# EAGLE schematic oresat-acs-card (EAGLE 9.6.2)

## Sheet 1 of 8: Connectors
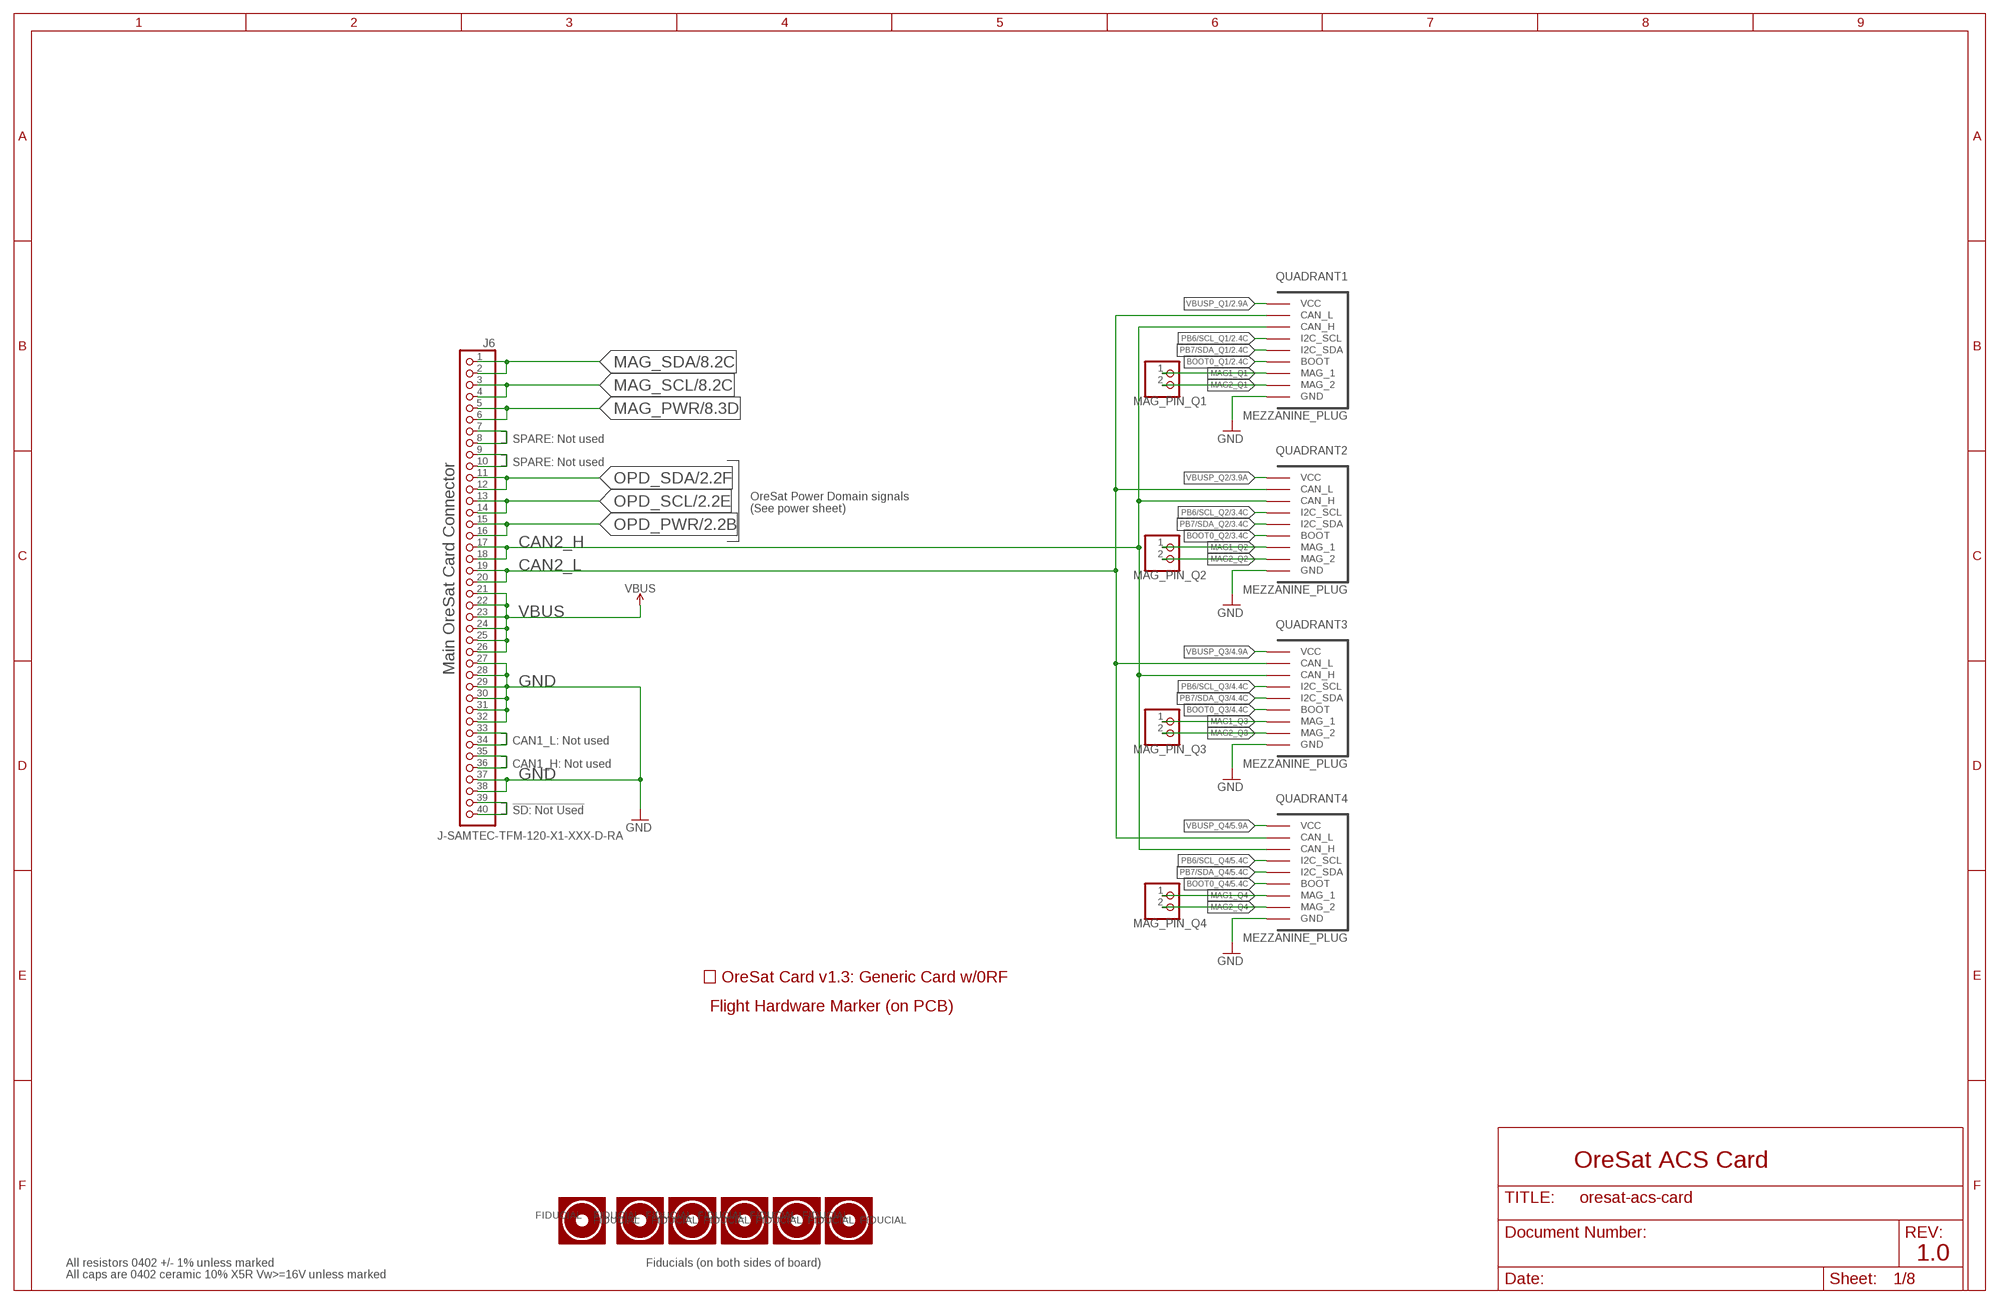
[diagram p0: schematic, sheet 1]

### Parts
FIDUCIAL1  FIDUCIAL-1.0X2.0  [FIDUCIAL-1.0X2.0]
FIDUCIAL2  FIDUCIAL-1.0X2.0  [FIDUCIAL-1.0X2.0]
FIDUCIAL3  FIDUCIAL-1.0X2.0  [FIDUCIAL-1.0X2.0]
FIDUCIAL4  FIDUCIAL-1.0X2.0  [FIDUCIAL-1.0X2.0]
FIDUCIAL5  FIDUCIAL-1.0X2.0  [FIDUCIAL-1.0X2.0]
FIDUCIAL6  FIDUCIAL-1.0X2.0  [FIDUCIAL-1.0X2.0]
J6  J-SAMTEC-TFM-120-X1-XXX-D-RA  [J-SAMTEC-TFM-120-X1-XXX-D-RA]
MAG_PIN_Q1  PINHD-1X2  [1X02]
MAG_PIN_Q2  PINHD-1X2  [1X02]
MAG_PIN_Q3  PINHD-1X2  [1X02]
MAG_PIN_Q4  PINHD-1X2  [1X02]
PCB1  ORESAT-CARD-V1.3-GENERIC-0RF  [ORESAT-CARD-V1.3-GENERIC-0RF]
QUADRANT1  MEZZANINE_PLUG  [MEZZANINE_PLUG]
QUADRANT2  MEZZANINE_PLUG  [MEZZANINE_PLUG]
QUADRANT3  MEZZANINE_PLUG  [MEZZANINE_PLUG]
QUADRANT4  MEZZANINE_PLUG  [MEZZANINE_PLUG]
U$1  FLIGHMARKERNEW  [FLIGHTMARKER_NEW_BOARDS]

### Nets
BOOT0_Q1: QUADRANT1.P$9(BOOT) QUADRANT1.P$22(BOOT) ; also sheet 2
BOOT0_Q2: QUADRANT2.P$9(BOOT) QUADRANT2.P$22(BOOT) ; also sheet 3
BOOT0_Q3: QUADRANT3.P$9(BOOT) QUADRANT3.P$22(BOOT) ; also sheet 4
BOOT0_Q4: QUADRANT4.P$9(BOOT) QUADRANT4.P$22(BOOT) ; also sheet 5
CAN2_H: J6.17 J6.18 QUADRANT1.P$6(CAN_H) QUADRANT1.P$25(CAN_H) QUADRANT2.P$6(CAN_H) QUADRANT2.P$25(CAN_H) QUADRANT3.P$6(CAN_H) QUADRANT3.P$25(CAN_H) QUADRANT4.P$6(CAN_H) QUADRANT4.P$25(CAN_H) ; also sheet 7
CAN2_L: J6.19 J6.20 QUADRANT1.P$5(CAN_L) QUADRANT1.P$26(CAN_L) QUADRANT2.P$5(CAN_L) QUADRANT2.P$26(CAN_L) QUADRANT3.P$5(CAN_L) QUADRANT3.P$26(CAN_L) QUADRANT4.P$5(CAN_L) QUADRANT4.P$26(CAN_L) ; also sheet 7
GND: J6.27 J6.28 J6.29 J6.30 J6.31 J6.32 J6.37 J6.38 QUADRANT1.P$1(GND) QUADRANT1.P$2(GND) QUADRANT1.P$14(GND) QUADRANT1.P$15(GND) QUADRANT1.P$16(GND) QUADRANT1.P$17(GND) QUADRANT1.P$29(GND) QUADRANT1.P$30(GND) QUADRANT2.P$1(GND) QUADRANT2.P$2(GND) QUADRANT2.P$14(GND) QUADRANT2.P$15(GND) QUADRANT2.P$16(GND) QUADRANT2.P$17(GND) QUADRANT2.P$29(GND) QUADRANT2.P$30(GND) QUADRANT3.P$1(GND) QUADRANT3.P$2(GND) QUADRANT3.P$14(GND) QUADRANT3.P$15(GND) QUADRANT3.P$16(GND) QUADRANT3.P$17(GND) QUADRANT3.P$29(GND) QUADRANT3.P$30(GND) QUADRANT4.P$1(GND) QUADRANT4.P$2(GND) QUADRANT4.P$14(GND) QUADRANT4.P$15(GND) QUADRANT4.P$16(GND) QUADRANT4.P$17(GND) QUADRANT4.P$29(GND) QUADRANT4.P$30(GND) ; also sheet 2,3,4,5,6,7,8
MAG1_Q1: MAG_PIN_Q1.1 QUADRANT1.P$10(MAG_1) QUADRANT1.P$21(MAG_1)
MAG1_Q2: MAG_PIN_Q2.1 QUADRANT2.P$10(MAG_1) QUADRANT2.P$21(MAG_1)
MAG1_Q3: MAG_PIN_Q3.1 QUADRANT3.P$10(MAG_1) QUADRANT3.P$21(MAG_1)
MAG1_Q4: MAG_PIN_Q4.1 QUADRANT4.P$10(MAG_1) QUADRANT4.P$21(MAG_1)
MAG2_Q1: MAG_PIN_Q1.2 QUADRANT1.P$11(MAG_2) QUADRANT1.P$20(MAG_2)
MAG2_Q2: MAG_PIN_Q2.2 QUADRANT2.P$11(MAG_2) QUADRANT2.P$20(MAG_2)
MAG2_Q3: MAG_PIN_Q3.2 QUADRANT3.P$11(MAG_2) QUADRANT3.P$20(MAG_2)
MAG2_Q4: MAG_PIN_Q4.2 QUADRANT4.P$11(MAG_2) QUADRANT4.P$20(MAG_2)
MAG_PWR: J6.5 J6.6 ; also sheet 8
MAG_SCL: J6.3 J6.4 ; also sheet 8
MAG_SDA: J6.1 J6.2 ; also sheet 8
N$47: J6.9 J6.10
N$48: J6.7 J6.8
N$49: J6.39 J6.40
N$50: J6.35 J6.36
N$51: J6.33 J6.34
OPD_PWR: J6.15 J6.16 ; also sheet 2,3,4,5,6
OPD_SCL: J6.13 J6.14 ; also sheet 2,3,4,5,6
OPD_SDA: J6.11 J6.12 ; also sheet 2,3,4,5,6
PB6/SCL_Q1: QUADRANT1.P$7(I2C_SCL) QUADRANT1.P$24(I2C_SCL) ; also sheet 2
PB6/SCL_Q2: QUADRANT2.P$7(I2C_SCL) QUADRANT2.P$24(I2C_SCL) ; also sheet 3
PB6/SCL_Q3: QUADRANT3.P$7(I2C_SCL) QUADRANT3.P$24(I2C_SCL) ; also sheet 4
PB6/SCL_Q4: QUADRANT4.P$7(I2C_SCL) QUADRANT4.P$24(I2C_SCL) ; also sheet 5
PB7/SDA_Q1: QUADRANT1.P$8(I2C_SDA) QUADRANT1.P$23(I2C_SDA) ; also sheet 2
PB7/SDA_Q2: QUADRANT2.P$8(I2C_SDA) QUADRANT2.P$23(I2C_SDA) ; also sheet 3
PB7/SDA_Q3: QUADRANT3.P$8(I2C_SDA) QUADRANT3.P$23(I2C_SDA) ; also sheet 4
PB7/SDA_Q4: QUADRANT4.P$8(I2C_SDA) QUADRANT4.P$23(I2C_SDA) ; also sheet 5
VBUS: J6.21 J6.22 J6.23 J6.24 J6.25 J6.26 ; also sheet 2,3,4,5,6
VBUSP_Q1: QUADRANT1.P$3(VCC) QUADRANT1.P$4(VCC) QUADRANT1.P$12(VCC) QUADRANT1.P$13(VCC) QUADRANT1.P$18(VCC) QUADRANT1.P$19(VCC) QUADRANT1.P$27(VCC) QUADRANT1.P$28(VCC) ; also sheet 2
VBUSP_Q2: QUADRANT2.P$3(VCC) QUADRANT2.P$4(VCC) QUADRANT2.P$12(VCC) QUADRANT2.P$13(VCC) QUADRANT2.P$18(VCC) QUADRANT2.P$19(VCC) QUADRANT2.P$27(VCC) QUADRANT2.P$28(VCC) ; also sheet 3
VBUSP_Q3: QUADRANT3.P$3(VCC) QUADRANT3.P$4(VCC) QUADRANT3.P$12(VCC) QUADRANT3.P$13(VCC) QUADRANT3.P$18(VCC) QUADRANT3.P$19(VCC) QUADRANT3.P$27(VCC) QUADRANT3.P$28(VCC) ; also sheet 4
VBUSP_Q4: QUADRANT4.P$3(VCC) QUADRANT4.P$4(VCC) QUADRANT4.P$12(VCC) QUADRANT4.P$13(VCC) QUADRANT4.P$18(VCC) QUADRANT4.P$19(VCC) QUADRANT4.P$27(VCC) QUADRANT4.P$28(VCC) ; also sheet 5
Unconnected: FIDUCIAL1.FIDUCIAL FIDUCIAL2.FIDUCIAL FIDUCIAL3.FIDUCIAL FIDUCIAL4.FIDUCIAL FIDUCIAL5.FIDUCIAL FIDUCIAL6.FIDUCIAL

### Notes on the sheet
- SPARE: Not used
- SPARE: Not used
- OreSat Power Domain signals
  (See power sheet)
- Main OreSat Card Connector
- CAN1_L: Not used
- CAN1_H: Not used
- !SD: Not Used
- OreSat ACS Card
- 1.0
- All resistors 0402 +/- 1% unless marked | Fiducials (on both sides of board)
- All caps are 0402 ceramic 10% X5R Vw>=16V unless marked

## Sheet 2 of 8: Q1 Power Domain
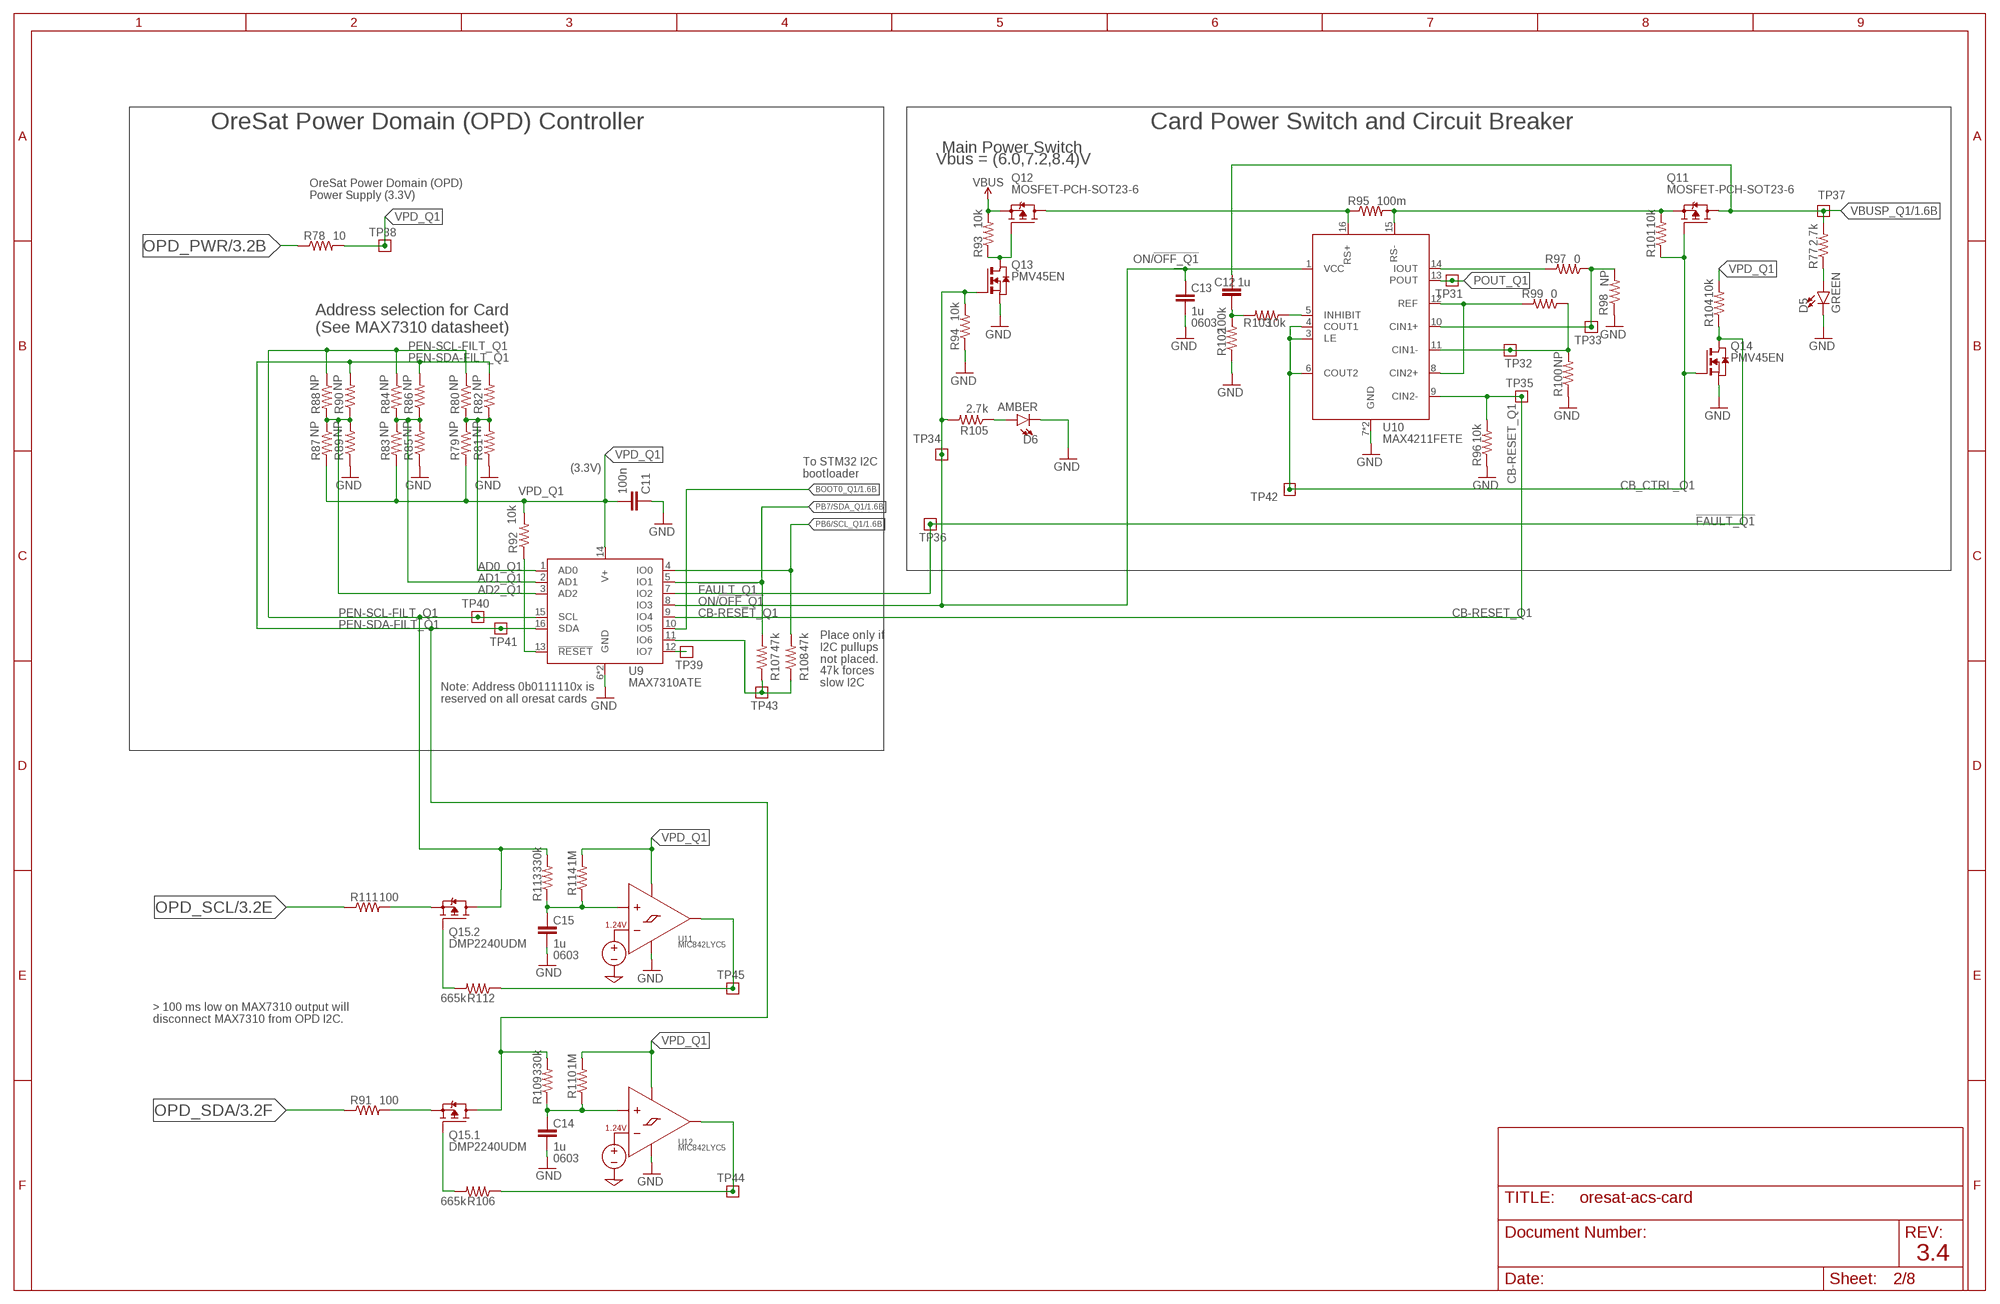
[diagram p1: schematic, sheet 2]

### Parts
C11  100n  C-EU0603-C-NOSILK  [.0603-C-NOSILK]
C12  1u  C-EU0603-C-NOSILK  [.0603-C-NOSILK]
C13  1u  C-EU0603-C-NOSILK  [.0603-C-NOSILK]
C14  1u  C-EU0603-C-NOSILK  [.0603-C-NOSILK]
C15  1u  C-EU0603-C-NOSILK  [.0603-C-NOSILK]
D5  GREEN  LED-GREEN0603  [LED-0603]
D6  AMBER  LED-GREEN0603  [LED-0603]
Q11  MOSFET-PCH-SOT23-6  [SOT23-6]
Q12  MOSFET-PCH-SOT23-6  [SOT23-6]
Q13  PMV45EN  [SOT23]
Q14  PMV45EN  [SOT23]
Q15  DMP2240UDM  MOSFET-PCH-SOT23-6  [SOT23-6]
R77  2.7k  R-US_0603-C-NOSILK  [.0603-C-NOSILK]
R78  10  R-US_0603-C-NOSILK  [.0603-C-NOSILK]
R79  NP  R-US_0603-C-NOSILK  [.0603-C-NOSILK]
R80  NP  R-US_0603-C-NOSILK  [.0603-C-NOSILK]
R81  NP  R-US_0603-C-NOSILK  [.0603-C-NOSILK]
R82  NP  R-US_0603-C-NOSILK  [.0603-C-NOSILK]
R83  NP  R-US_0603-C-NOSILK  [.0603-C-NOSILK]
R84  NP  R-US_0603-C-NOSILK  [.0603-C-NOSILK]
R85  NP  R-US_0603-C-NOSILK  [.0603-C-NOSILK]
R86  NP  R-US_0603-C-NOSILK  [.0603-C-NOSILK]
R87  NP  R-US_0603-C-NOSILK  [.0603-C-NOSILK]
R88  NP  R-US_0603-C-NOSILK  [.0603-C-NOSILK]
R89  NP  R-US_0603-C-NOSILK  [.0603-C-NOSILK]
R90  NP  R-US_0603-C-NOSILK  [.0603-C-NOSILK]
R91  100  R-US_0603-C-NOSILK  [.0603-C-NOSILK]
R92  10k  R-US_0603-C-NOSILK  [.0603-C-NOSILK]
R93  10k  R-US_0603-C-NOSILK  [.0603-C-NOSILK]
R94  10k  R-US_0603-C-NOSILK  [.0603-C-NOSILK]
R95  100m  R-US_R1206  [R1206]
R96  10k  R-US_0603-C-NOSILK  [.0603-C-NOSILK]
R97  0  R-US_0603-C-NOSILK  [.0603-C-NOSILK]
R98  NP  R-US_0603-C-NOSILK  [.0603-C-NOSILK]
R99  0  R-US_0603-C-NOSILK  [.0603-C-NOSILK]
R100  NP  R-US_0603-C-NOSILK  [.0603-C-NOSILK]
R101  10k  R-US_0603-C-NOSILK  [.0603-C-NOSILK]
R102  100k  R-US_0603-C-NOSILK  [.0603-C-NOSILK]
R103  10k  R-US_0603-C-NOSILK  [.0603-C-NOSILK]
R104  10k  R-US_0603-C-NOSILK  [.0603-C-NOSILK]
R105  2.7k  R-US_0603-C-NOSILK  [.0603-C-NOSILK]
R106  665k  R-US_0603-C-NOSILK  [.0603-C-NOSILK]
R107  47k  R-US_0603-C-NOSILK  [.0603-C-NOSILK]
R108  47k  R-US_0603-C-NOSILK  [.0603-C-NOSILK]
R109  330k  R-US_0603-C-NOSILK  [.0603-C-NOSILK]
R110  1M  R-US_0603-C-NOSILK  [.0603-C-NOSILK]
R111  100  R-US_0603-C-NOSILK  [.0603-C-NOSILK]
R112  665k  R-US_0603-C-NOSILK  [.0603-C-NOSILK]
R113  330k  R-US_0603-C-NOSILK  [.0603-C-NOSILK]
R114  1M  R-US_0603-C-NOSILK  [.0603-C-NOSILK]
TP31  TEST-POINT-LARGE-SQUARE  [1X01]
TP32  TEST-POINT-LARGE-SQUARE  [1X01]
TP33  TEST-POINT-LARGE-SQUARE  [1X01]
TP34  TEST-POINT-LARGE-SQUARE  [1X01]
TP35  TEST-POINT-LARGE-SQUARE  [1X01]
TP36  TEST-POINT-LARGE-SQUARE  [1X01]
TP37  TEST-POINT-LARGE-SQUARE  [1X01]
TP38  TEST-POINT-LARGE-SQUARE  [1X01]
TP39  TEST-POINT-LARGE-SQUARE  [1X01]
TP40  TEST-POINT-LARGE-SQUARE  [1X01]
TP41  TEST-POINT-LARGE-SQUARE  [1X01]
TP42  TEST-POINT-LARGE-SQUARE  [1X01]
TP43  TEST-POINT-LARGE-SQUARE  [1X01]
TP44  TEST-POINT-LARGE-SQUARE  [1X01]
TP45  TEST-POINT-LARGE-SQUARE  [1X01]
U9  MAX7310ATE  MAX7310  [QFN65P400X400X80-17T210]
U10  MAX4211FETE  MAX4211  [QFN65P400X400X80-17T210]
U11  MIC842LYC5  [SC70-5]
U12  MIC842LYC5  [SC70-5]

### Nets
!FAULT_Q1: Q14.3(D) R104.1 TP36.1 U9.7(IO2)
AD0_Q1: R79.1 R80.2 R81.2 R82.1 U9.1(AD0)
AD1_Q1: R83.1 R84.2 R85.2 R86.1 U9.2(AD1)
AD2_Q1: R87.1 R88.2 R89.2 R90.1 U9.3(AD2)
BOOT0_Q1: U9.10(IO5) ; also sheet 1
CB-RESET_Q1: R96.2 TP35.1 U9.9(IO4) U10.9(CIN2-)
CB_CTRL_Q1: Q11.3(G) Q14.1(G) R101.1 TP42.1 U10.3(LE) U10.4(COUT1) U10.6(COUT2)
GND: C11.1 C13.2 C14.2 C15.2 D5.C D6.C Q13.2(S) Q14.2(S) R81.1 R85.1 R89.1 R94.1 R96.1 R98.1 R100.1 R102.1 U9.6(GND) U9.EPAD(GND) U10.7(GND) U10.EPAD(GND) U11.2(GND) U12.2(GND) ; also sheet 1,3,4,5,6,7,8
IOUT_Q1: R97.2 U10.14(IOUT)
N$2: TP39.1 U9.12(IO7)
N$28: Q15.3(.2:G) R112.2
N$29: Q15.1(.1:G) R106.2
N$169: D5.A R77.1
N$170: R92.1 U9.13(!RESET)
N$171: Q12.3(G) Q13.3(D) R93.1
N$172: Q12.1(D) Q12.2(D) Q12.5(D) Q12.6(D) R95.1 U10.16(RS+)
N$173: R97.1 R98.2 TP33.1 U10.10(CIN1+)
N$174: R99.1 R100.2 TP32.1 U10.11(CIN1-)
N$175: R99.2 U10.8(CIN2+) U10.12(REF)
N$176: R103.1 U10.5(INHIBIT)
N$177: C12.1 R102.2 R103.2
N$178: Q11.4(S) R95.2 R101.2 U10.15(RS-)
N$179: D6.A R105.1
N$180: Q15.5(.1:S) R91.2
N$181: R106.1 TP44.1 U12.4(OUT)
N$182: R107.1 R108.1 TP43.1 U9.11(IO6)
N$183: Q15.2(.2:S) R111.2
N$184: R112.1 TP45.1 U11.4(OUT)
N$185: C15.1 R113.1 R114.1 U11.1(INP)
N$186: C14.1 R109.1 R110.1 U12.1(INP)
ON/!OFF_Q1: C13.1 Q13.1(G) R94.2 R105.2 TP34.1 U9.8(IO3) U10.1(VCC)
OPD_PWR: R78.1 ; also sheet 1,3,4,5,6
OPD_SCL: R111.1 ; also sheet 1,3,4,5,6
OPD_SDA: R91.1 ; also sheet 1,3,4,5,6
PB6/SCL_Q1: R108.2 U9.4(IO0) ; also sheet 1
PB7/SDA_Q1: R107.2 U9.5(IO1) ; also sheet 1
PEN-SCL-FILT_Q1: Q15.4(.2:D) R80.1 R84.1 R88.1 R113.2 TP40.1 U9.15(SCL)
PEN-SDA-FILT_Q1: Q15.6(.1:D) R82.2 R86.2 R90.2 R109.2 TP41.1 U9.16(SDA)
POUT_Q1: TP31.1 U10.13(POUT)
VBUS: Q12.4(S) R93.2 ; also sheet 1,3,4,5,6
VBUSP_Q1: C12.2 Q11.1(D) Q11.2(D) Q11.5(D) Q11.6(D) R77.2 TP37.1 ; also sheet 1
VPD_Q1: C11.2 R78.2 R79.2 R83.2 R87.2 R92.2 R104.2 R110.2 R114.2 TP38.1 U9.14(V+) U11.5(VDD) U12.5(VDD)

### Notes on the sheet
- OreSat Power Domain (OPD) Controller | Card Power Switch and Circuit Breaker
- Main Power Switch
- Vbus = (6.0,7.2,8.4)V
- OreSat Power Domain (OPD)
  Power Supply (3.3V)
- 0603
- Address selection for Card
  (See MAX7310 datasheet)
- (3.3V)
- To STM32 I2C
  bootloader
- Place only if
  I2C pullups
  not placed.
- 47k forces
  slow I2C
- Note: Address 0b0111110x is 
  reserved on all oresat cards
- 0603
- > 100 ms low on MAX7310 output will
  disconnect MAX7310 from OPD I2C.
- 0603
- 3.4

## Sheet 3 of 8: Q2 Power Domain
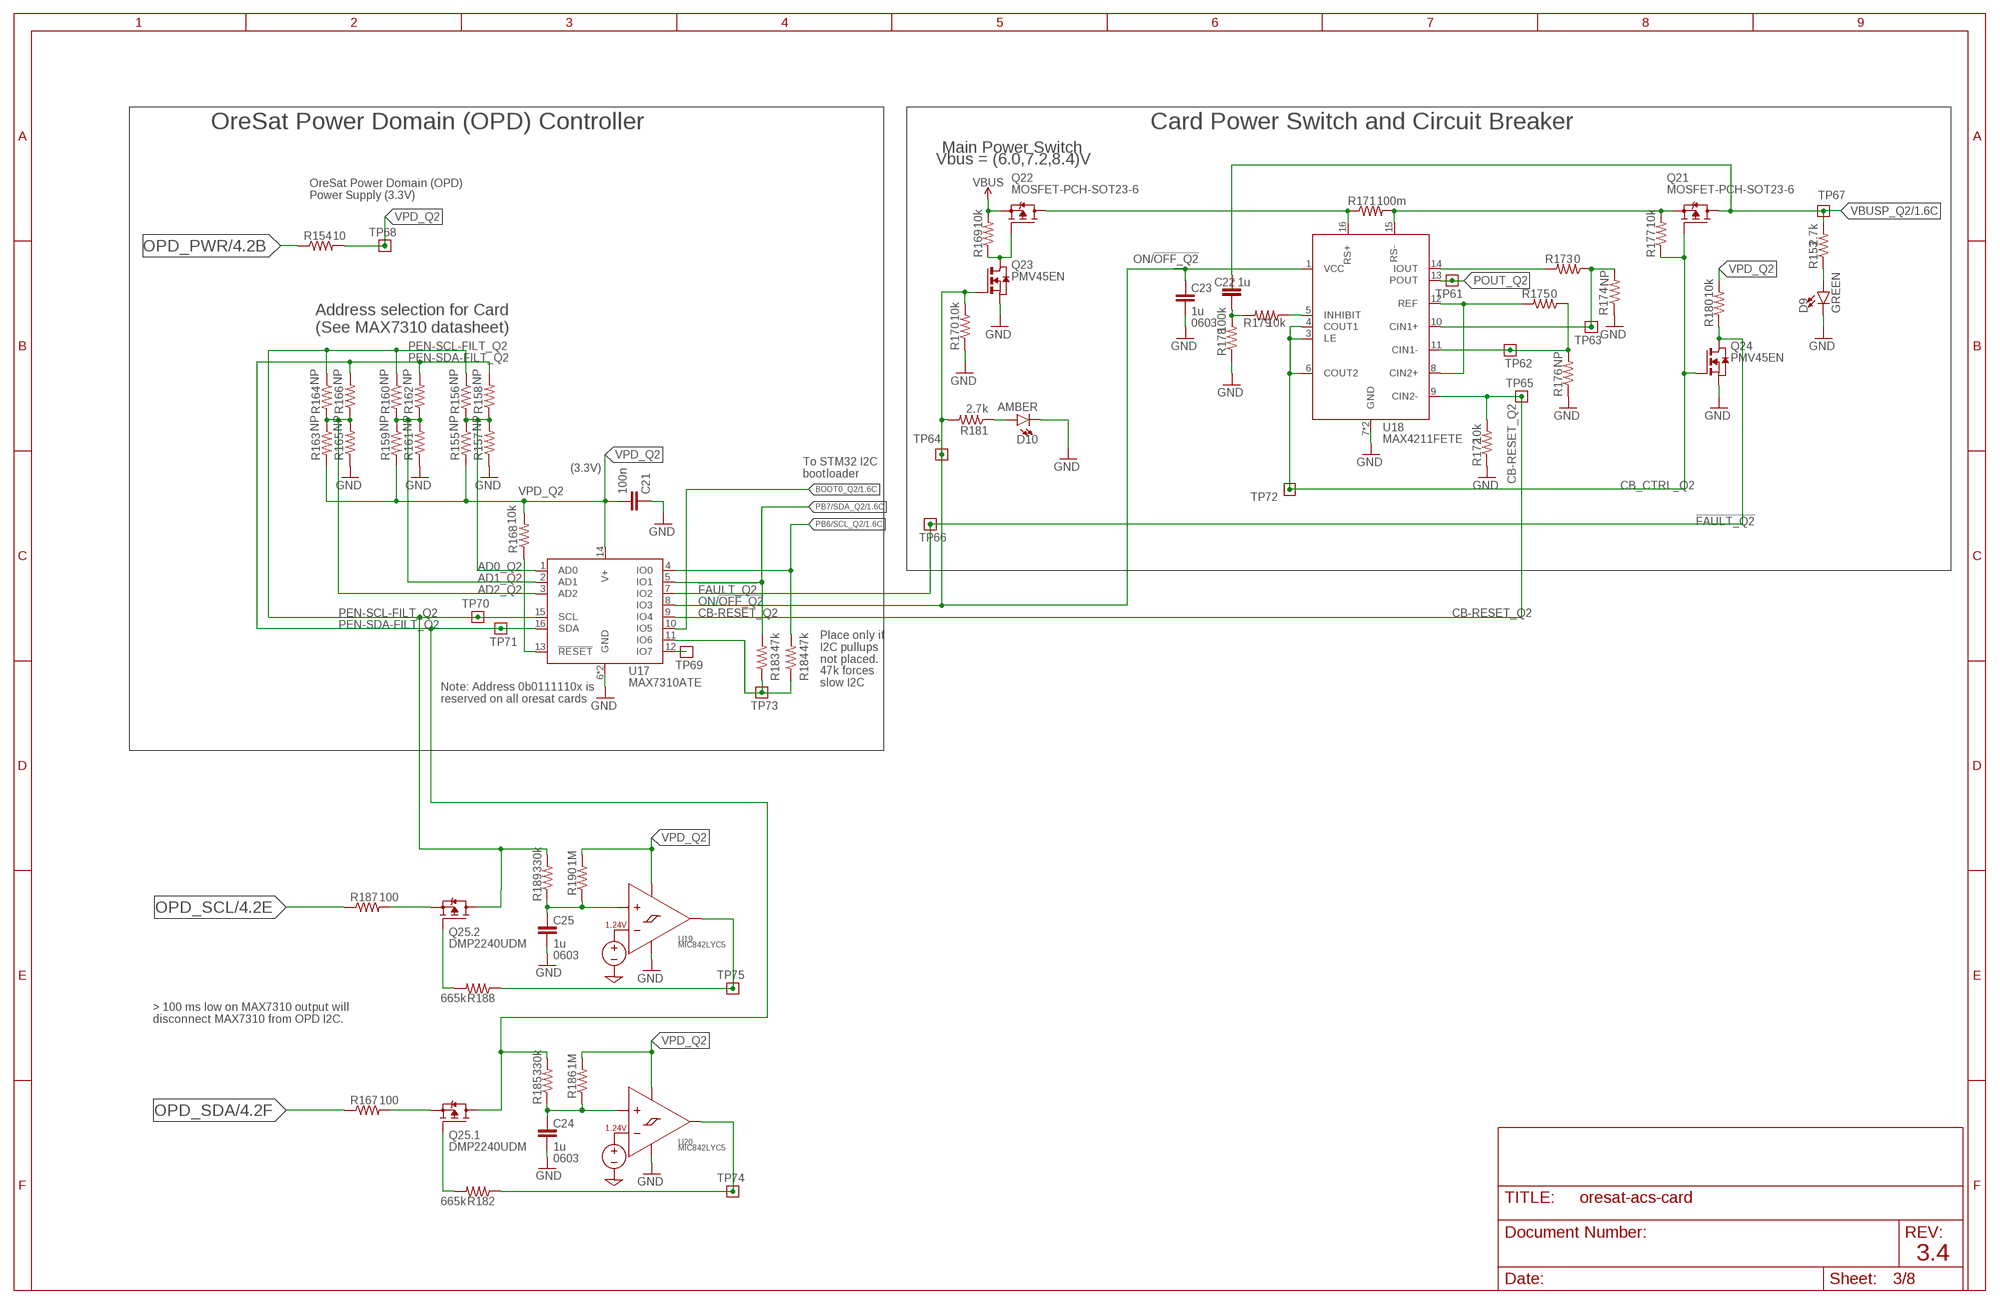
[diagram p2: schematic, sheet 3]

### Parts
C21  100n  C-EU0603-C-NOSILK  [.0603-C-NOSILK]
C22  1u  C-EU0603-C-NOSILK  [.0603-C-NOSILK]
C23  1u  C-EU0603-C-NOSILK  [.0603-C-NOSILK]
C24  1u  C-EU0603-C-NOSILK  [.0603-C-NOSILK]
C25  1u  C-EU0603-C-NOSILK  [.0603-C-NOSILK]
D9  GREEN  LED-GREEN0603  [LED-0603]
D10  AMBER  LED-GREEN0603  [LED-0603]
Q21  MOSFET-PCH-SOT23-6  [SOT23-6]
Q22  MOSFET-PCH-SOT23-6  [SOT23-6]
Q23  PMV45EN  [SOT23]
Q24  PMV45EN  [SOT23]
Q25  DMP2240UDM  MOSFET-PCH-SOT23-6  [SOT23-6]
R153  2.7k  R-US_0603-C-NOSILK  [.0603-C-NOSILK]
R154  10  R-US_0603-C-NOSILK  [.0603-C-NOSILK]
R155  NP  R-US_0603-C-NOSILK  [.0603-C-NOSILK]
R156  NP  R-US_0603-C-NOSILK  [.0603-C-NOSILK]
R157  NP  R-US_0603-C-NOSILK  [.0603-C-NOSILK]
R158  NP  R-US_0603-C-NOSILK  [.0603-C-NOSILK]
R159  NP  R-US_0603-C-NOSILK  [.0603-C-NOSILK]
R160  NP  R-US_0603-C-NOSILK  [.0603-C-NOSILK]
R161  NP  R-US_0603-C-NOSILK  [.0603-C-NOSILK]
R162  NP  R-US_0603-C-NOSILK  [.0603-C-NOSILK]
R163  NP  R-US_0603-C-NOSILK  [.0603-C-NOSILK]
R164  NP  R-US_0603-C-NOSILK  [.0603-C-NOSILK]
R165  NP  R-US_0603-C-NOSILK  [.0603-C-NOSILK]
R166  NP  R-US_0603-C-NOSILK  [.0603-C-NOSILK]
R167  100  R-US_0603-C-NOSILK  [.0603-C-NOSILK]
R168  10k  R-US_0603-C-NOSILK  [.0603-C-NOSILK]
R169  10k  R-US_0603-C-NOSILK  [.0603-C-NOSILK]
R170  10k  R-US_0603-C-NOSILK  [.0603-C-NOSILK]
R171  100m  R-US_R1206  [R1206]
R172  10k  R-US_0603-C-NOSILK  [.0603-C-NOSILK]
R173  0  R-US_0603-C-NOSILK  [.0603-C-NOSILK]
R174  NP  R-US_0603-C-NOSILK  [.0603-C-NOSILK]
R175  0  R-US_0603-C-NOSILK  [.0603-C-NOSILK]
R176  NP  R-US_0603-C-NOSILK  [.0603-C-NOSILK]
R177  10k  R-US_0603-C-NOSILK  [.0603-C-NOSILK]
R178  100k  R-US_0603-C-NOSILK  [.0603-C-NOSILK]
R179  10k  R-US_0603-C-NOSILK  [.0603-C-NOSILK]
R180  10k  R-US_0603-C-NOSILK  [.0603-C-NOSILK]
R181  2.7k  R-US_0603-C-NOSILK  [.0603-C-NOSILK]
R182  665k  R-US_0603-C-NOSILK  [.0603-C-NOSILK]
R183  47k  R-US_0603-C-NOSILK  [.0603-C-NOSILK]
R184  47k  R-US_0603-C-NOSILK  [.0603-C-NOSILK]
R185  330k  R-US_0603-C-NOSILK  [.0603-C-NOSILK]
R186  1M  R-US_0603-C-NOSILK  [.0603-C-NOSILK]
R187  100  R-US_0603-C-NOSILK  [.0603-C-NOSILK]
R188  665k  R-US_0603-C-NOSILK  [.0603-C-NOSILK]
R189  330k  R-US_0603-C-NOSILK  [.0603-C-NOSILK]
R190  1M  R-US_0603-C-NOSILK  [.0603-C-NOSILK]
TP61  TEST-POINT-LARGE-SQUARE  [1X01]
TP62  TEST-POINT-LARGE-SQUARE  [1X01]
TP63  TEST-POINT-LARGE-SQUARE  [1X01]
TP64  TEST-POINT-LARGE-SQUARE  [1X01]
TP65  TEST-POINT-LARGE-SQUARE  [1X01]
TP66  TEST-POINT-LARGE-SQUARE  [1X01]
TP67  TEST-POINT-LARGE-SQUARE  [1X01]
TP68  TEST-POINT-LARGE-SQUARE  [1X01]
TP69  TEST-POINT-LARGE-SQUARE  [1X01]
TP70  TEST-POINT-LARGE-SQUARE  [1X01]
TP71  TEST-POINT-LARGE-SQUARE  [1X01]
TP72  TEST-POINT-LARGE-SQUARE  [1X01]
TP73  TEST-POINT-LARGE-SQUARE  [1X01]
TP74  TEST-POINT-LARGE-SQUARE  [1X01]
TP75  TEST-POINT-LARGE-SQUARE  [1X01]
U17  MAX7310ATE  MAX7310  [QFN65P400X400X80-17T210]
U18  MAX4211FETE  MAX4211  [QFN65P400X400X80-17T210]
U19  MIC842LYC5  [SC70-5]
U20  MIC842LYC5  [SC70-5]

### Nets
!FAULT_Q2: Q24.3(D) R180.1 TP66.1 U17.7(IO2)
AD0_Q2: R155.1 R156.2 R157.2 R158.1 U17.1(AD0)
AD1_Q2: R159.1 R160.2 R161.2 R162.1 U17.2(AD1)
AD2_Q2: R163.1 R164.2 R165.2 R166.1 U17.3(AD2)
BOOT0_Q2: U17.10(IO5) ; also sheet 1
CB-RESET_Q2: R172.2 TP65.1 U17.9(IO4) U18.9(CIN2-)
CB_CTRL_Q2: Q21.3(G) Q24.1(G) R177.1 TP72.1 U18.3(LE) U18.4(COUT1) U18.6(COUT2)
GND: C21.1 C23.2 C24.2 C25.2 D9.C D10.C Q23.2(S) Q24.2(S) R157.1 R161.1 R165.1 R170.1 R172.1 R174.1 R176.1 R178.1 U17.6(GND) U17.EPAD(GND) U18.7(GND) U18.EPAD(GND) U19.2(GND) U20.2(GND) ; also sheet 1,2,4,5,6,7,8
IOUT_Q2: R173.2 U18.14(IOUT)
N$3: TP69.1 U17.12(IO7)
N$30: Q25.3(.2:G) R188.2
N$41: Q25.1(.1:G) R182.2
N$205: D9.A R153.1
N$206: R168.1 U17.13(!RESET)
N$207: Q22.3(G) Q23.3(D) R169.1
N$208: Q22.1(D) Q22.2(D) Q22.5(D) Q22.6(D) R171.1 U18.16(RS+)
N$209: R173.1 R174.2 TP63.1 U18.10(CIN1+)
N$210: R175.1 R176.2 TP62.1 U18.11(CIN1-)
N$211: R175.2 U18.8(CIN2+) U18.12(REF)
N$212: R179.1 U18.5(INHIBIT)
N$213: C22.1 R178.2 R179.2
N$214: Q21.4(S) R171.2 R177.2 U18.15(RS-)
N$215: D10.A R181.1
N$216: Q25.5(.1:S) R167.2
N$217: R182.1 TP74.1 U20.4(OUT)
N$218: R183.1 R184.1 TP73.1 U17.11(IO6)
N$219: Q25.2(.2:S) R187.2
N$220: R188.1 TP75.1 U19.4(OUT)
N$221: C25.1 R189.1 R190.1 U19.1(INP)
N$222: C24.1 R185.1 R186.1 U20.1(INP)
ON/!OFF_Q2: C23.1 Q23.1(G) R170.2 R181.2 TP64.1 U17.8(IO3) U18.1(VCC)
OPD_PWR: R154.1 ; also sheet 1,2,4,5,6
OPD_SCL: R187.1 ; also sheet 1,2,4,5,6
OPD_SDA: R167.1 ; also sheet 1,2,4,5,6
PB6/SCL_Q2: R184.2 U17.4(IO0) ; also sheet 1
PB7/SDA_Q2: R183.2 U17.5(IO1) ; also sheet 1
PEN-SCL-FILT_Q2: Q25.4(.2:D) R156.1 R160.1 R164.1 R189.2 TP70.1 U17.15(SCL)
PEN-SDA-FILT_Q2: Q25.6(.1:D) R158.2 R162.2 R166.2 R185.2 TP71.1 U17.16(SDA)
POUT_Q2: TP61.1 U18.13(POUT)
VBUS: Q22.4(S) R169.2 ; also sheet 1,2,4,5,6
VBUSP_Q2: C22.2 Q21.1(D) Q21.2(D) Q21.5(D) Q21.6(D) R153.2 TP67.1 ; also sheet 1
VPD_Q2: C21.2 R154.2 R155.2 R159.2 R163.2 R168.2 R180.2 R186.2 R190.2 TP68.1 U17.14(V+) U19.5(VDD) U20.5(VDD)

### Notes on the sheet
- OreSat Power Domain (OPD) Controller | Card Power Switch and Circuit Breaker
- Main Power Switch
- Vbus = (6.0,7.2,8.4)V
- OreSat Power Domain (OPD)
  Power Supply (3.3V)
- 0603
- Address selection for Card
  (See MAX7310 datasheet)
- (3.3V)
- To STM32 I2C
  bootloader
- Place only if
  I2C pullups
  not placed.
- 47k forces
  slow I2C
- Note: Address 0b0111110x is 
  reserved on all oresat cards
- 0603
- > 100 ms low on MAX7310 output will
  disconnect MAX7310 from OPD I2C.
- 0603
- 3.4

## Sheet 4 of 8: Q3 Power Domain
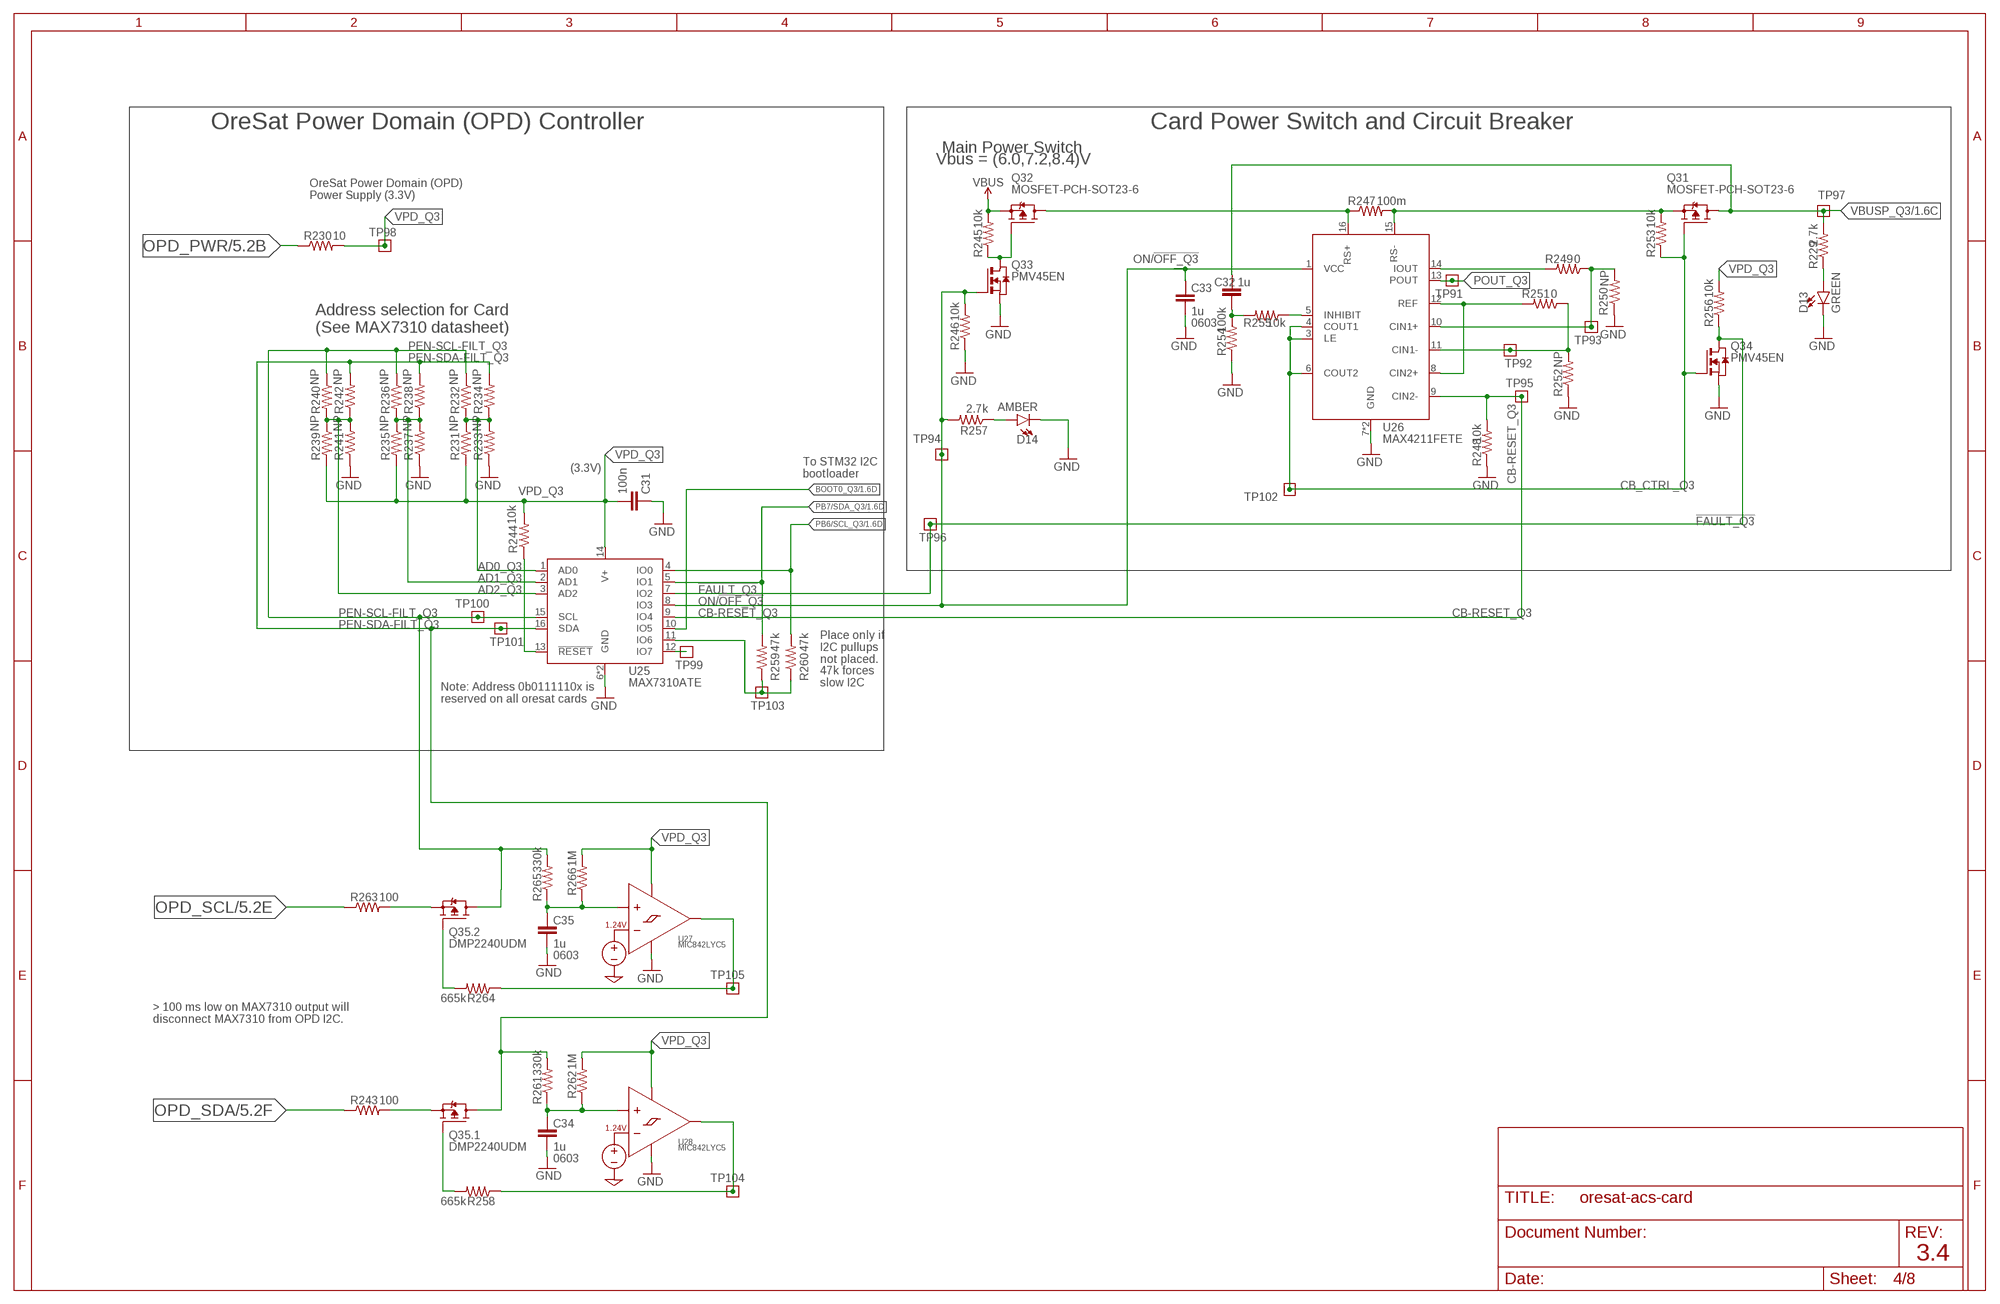
[diagram p3: schematic, sheet 4]

### Parts
C31  100n  C-EU0603-C-NOSILK  [.0603-C-NOSILK]
C32  1u  C-EU0603-C-NOSILK  [.0603-C-NOSILK]
C33  1u  C-EU0603-C-NOSILK  [.0603-C-NOSILK]
C34  1u  C-EU0603-C-NOSILK  [.0603-C-NOSILK]
C35  1u  C-EU0603-C-NOSILK  [.0603-C-NOSILK]
D13  GREEN  LED-GREEN0603  [LED-0603]
D14  AMBER  LED-GREEN0603  [LED-0603]
Q31  MOSFET-PCH-SOT23-6  [SOT23-6]
Q32  MOSFET-PCH-SOT23-6  [SOT23-6]
Q33  PMV45EN  [SOT23]
Q34  PMV45EN  [SOT23]
Q35  DMP2240UDM  MOSFET-PCH-SOT23-6  [SOT23-6]
R229  2.7k  R-US_0603-C-NOSILK  [.0603-C-NOSILK]
R230  10  R-US_0603-C-NOSILK  [.0603-C-NOSILK]
R231  NP  R-US_0603-C-NOSILK  [.0603-C-NOSILK]
R232  NP  R-US_0603-C-NOSILK  [.0603-C-NOSILK]
R233  NP  R-US_0603-C-NOSILK  [.0603-C-NOSILK]
R234  NP  R-US_0603-C-NOSILK  [.0603-C-NOSILK]
R235  NP  R-US_0603-C-NOSILK  [.0603-C-NOSILK]
R236  NP  R-US_0603-C-NOSILK  [.0603-C-NOSILK]
R237  NP  R-US_0603-C-NOSILK  [.0603-C-NOSILK]
R238  NP  R-US_0603-C-NOSILK  [.0603-C-NOSILK]
R239  NP  R-US_0603-C-NOSILK  [.0603-C-NOSILK]
R240  NP  R-US_0603-C-NOSILK  [.0603-C-NOSILK]
R241  NP  R-US_0603-C-NOSILK  [.0603-C-NOSILK]
R242  NP  R-US_0603-C-NOSILK  [.0603-C-NOSILK]
R243  100  R-US_0603-C-NOSILK  [.0603-C-NOSILK]
R244  10k  R-US_0603-C-NOSILK  [.0603-C-NOSILK]
R245  10k  R-US_0603-C-NOSILK  [.0603-C-NOSILK]
R246  10k  R-US_0603-C-NOSILK  [.0603-C-NOSILK]
R247  100m  R-US_R1206  [R1206]
R248  10k  R-US_0603-C-NOSILK  [.0603-C-NOSILK]
R249  0  R-US_0603-C-NOSILK  [.0603-C-NOSILK]
R250  NP  R-US_0603-C-NOSILK  [.0603-C-NOSILK]
R251  0  R-US_0603-C-NOSILK  [.0603-C-NOSILK]
R252  NP  R-US_0603-C-NOSILK  [.0603-C-NOSILK]
R253  10k  R-US_0603-C-NOSILK  [.0603-C-NOSILK]
R254  100k  R-US_0603-C-NOSILK  [.0603-C-NOSILK]
R255  10k  R-US_0603-C-NOSILK  [.0603-C-NOSILK]
R256  10k  R-US_0603-C-NOSILK  [.0603-C-NOSILK]
R257  2.7k  R-US_0603-C-NOSILK  [.0603-C-NOSILK]
R258  665k  R-US_0603-C-NOSILK  [.0603-C-NOSILK]
R259  47k  R-US_0603-C-NOSILK  [.0603-C-NOSILK]
R260  47k  R-US_0603-C-NOSILK  [.0603-C-NOSILK]
R261  330k  R-US_0603-C-NOSILK  [.0603-C-NOSILK]
R262  1M  R-US_0603-C-NOSILK  [.0603-C-NOSILK]
R263  100  R-US_0603-C-NOSILK  [.0603-C-NOSILK]
R264  665k  R-US_0603-C-NOSILK  [.0603-C-NOSILK]
R265  330k  R-US_0603-C-NOSILK  [.0603-C-NOSILK]
R266  1M  R-US_0603-C-NOSILK  [.0603-C-NOSILK]
TP91  TEST-POINT-LARGE-SQUARE  [1X01]
TP92  TEST-POINT-LARGE-SQUARE  [1X01]
TP93  TEST-POINT-LARGE-SQUARE  [1X01]
TP94  TEST-POINT-LARGE-SQUARE  [1X01]
TP95  TEST-POINT-LARGE-SQUARE  [1X01]
TP96  TEST-POINT-LARGE-SQUARE  [1X01]
TP97  TEST-POINT-LARGE-SQUARE  [1X01]
TP98  TEST-POINT-LARGE-SQUARE  [1X01]
TP99  TEST-POINT-LARGE-SQUARE  [1X01]
TP100  TEST-POINT-LARGE-SQUARE  [1X01]
TP101  TEST-POINT-LARGE-SQUARE  [1X01]
TP102  TEST-POINT-LARGE-SQUARE  [1X01]
TP103  TEST-POINT-LARGE-SQUARE  [1X01]
TP104  TEST-POINT-LARGE-SQUARE  [1X01]
TP105  TEST-POINT-LARGE-SQUARE  [1X01]
U25  MAX7310ATE  MAX7310  [QFN65P400X400X80-17T210]
U26  MAX4211FETE  MAX4211  [QFN65P400X400X80-17T210]
U27  MIC842LYC5  [SC70-5]
U28  MIC842LYC5  [SC70-5]

### Nets
!FAULT_Q3: Q34.3(D) R256.1 TP96.1 U25.7(IO2)
AD0_Q3: R231.1 R232.2 R233.2 R234.1 U25.1(AD0)
AD1_Q3: R235.1 R236.2 R237.2 R238.1 U25.2(AD1)
AD2_Q3: R239.1 R240.2 R241.2 R242.1 U25.3(AD2)
BOOT0_Q3: U25.10(IO5) ; also sheet 1
CB-RESET_Q3: R248.2 TP95.1 U25.9(IO4) U26.9(CIN2-)
CB_CTRL_Q3: Q31.3(G) Q34.1(G) R253.1 TP102.1 U26.3(LE) U26.4(COUT1) U26.6(COUT2)
GND: C31.1 C33.2 C34.2 C35.2 D13.C D14.C Q33.2(S) Q34.2(S) R233.1 R237.1 R241.1 R246.1 R248.1 R250.1 R252.1 R254.1 U25.6(GND) U25.EPAD(GND) U26.7(GND) U26.EPAD(GND) U27.2(GND) U28.2(GND) ; also sheet 1,2,3,5,6,7,8
IOUT_Q_3: R249.2 U26.14(IOUT)
N$4: TP99.1 U25.12(IO7)
N$42: Q35.1(.1:G) R258.2
N$43: Q35.3(.2:G) R264.2
N$241: D13.A R229.1
N$242: R244.1 U25.13(!RESET)
N$243: Q32.3(G) Q33.3(D) R245.1
N$244: Q32.1(D) Q32.2(D) Q32.5(D) Q32.6(D) R247.1 U26.16(RS+)
N$245: R249.1 R250.2 TP93.1 U26.10(CIN1+)
N$246: R251.1 R252.2 TP92.1 U26.11(CIN1-)
N$247: R251.2 U26.8(CIN2+) U26.12(REF)
N$248: R255.1 U26.5(INHIBIT)
N$249: C32.1 R254.2 R255.2
N$250: Q31.4(S) R247.2 R253.2 U26.15(RS-)
N$251: D14.A R257.1
N$252: Q35.5(.1:S) R243.2
N$253: R258.1 TP104.1 U28.4(OUT)
N$254: R259.1 R260.1 TP103.1 U25.11(IO6)
N$255: Q35.2(.2:S) R263.2
N$256: R264.1 TP105.1 U27.4(OUT)
N$257: C35.1 R265.1 R266.1 U27.1(INP)
N$258: C34.1 R261.1 R262.1 U28.1(INP)
ON/!OFF_Q3: C33.1 Q33.1(G) R246.2 R257.2 TP94.1 U25.8(IO3) U26.1(VCC)
OPD_PWR: R230.1 ; also sheet 1,2,3,5,6
OPD_SCL: R263.1 ; also sheet 1,2,3,5,6
OPD_SDA: R243.1 ; also sheet 1,2,3,5,6
PB6/SCL_Q3: R260.2 U25.4(IO0) ; also sheet 1
PB7/SDA_Q3: R259.2 U25.5(IO1) ; also sheet 1
PEN-SCL-FILT_Q3: Q35.4(.2:D) R232.1 R236.1 R240.1 R265.2 TP100.1 U25.15(SCL)
PEN-SDA-FILT_Q3: Q35.6(.1:D) R234.2 R238.2 R242.2 R261.2 TP101.1 U25.16(SDA)
POUT_Q3: TP91.1 U26.13(POUT)
VBUS: Q32.4(S) R245.2 ; also sheet 1,2,3,5,6
VBUSP_Q3: C32.2 Q31.1(D) Q31.2(D) Q31.5(D) Q31.6(D) R229.2 TP97.1 ; also sheet 1
VPD_Q3: C31.2 R230.2 R231.2 R235.2 R239.2 R244.2 R256.2 R262.2 R266.2 TP98.1 U25.14(V+) U27.5(VDD) U28.5(VDD)

### Notes on the sheet
- OreSat Power Domain (OPD) Controller | Card Power Switch and Circuit Breaker
- Main Power Switch
- Vbus = (6.0,7.2,8.4)V
- OreSat Power Domain (OPD)
  Power Supply (3.3V)
- 0603
- Address selection for Card
  (See MAX7310 datasheet)
- (3.3V)
- To STM32 I2C
  bootloader
- Place only if
  I2C pullups
  not placed.
- 47k forces
  slow I2C
- Note: Address 0b0111110x is 
  reserved on all oresat cards
- 0603
- > 100 ms low on MAX7310 output will
  disconnect MAX7310 from OPD I2C.
- 0603
- 3.4

## Sheet 5 of 8: Q4 Power Domain
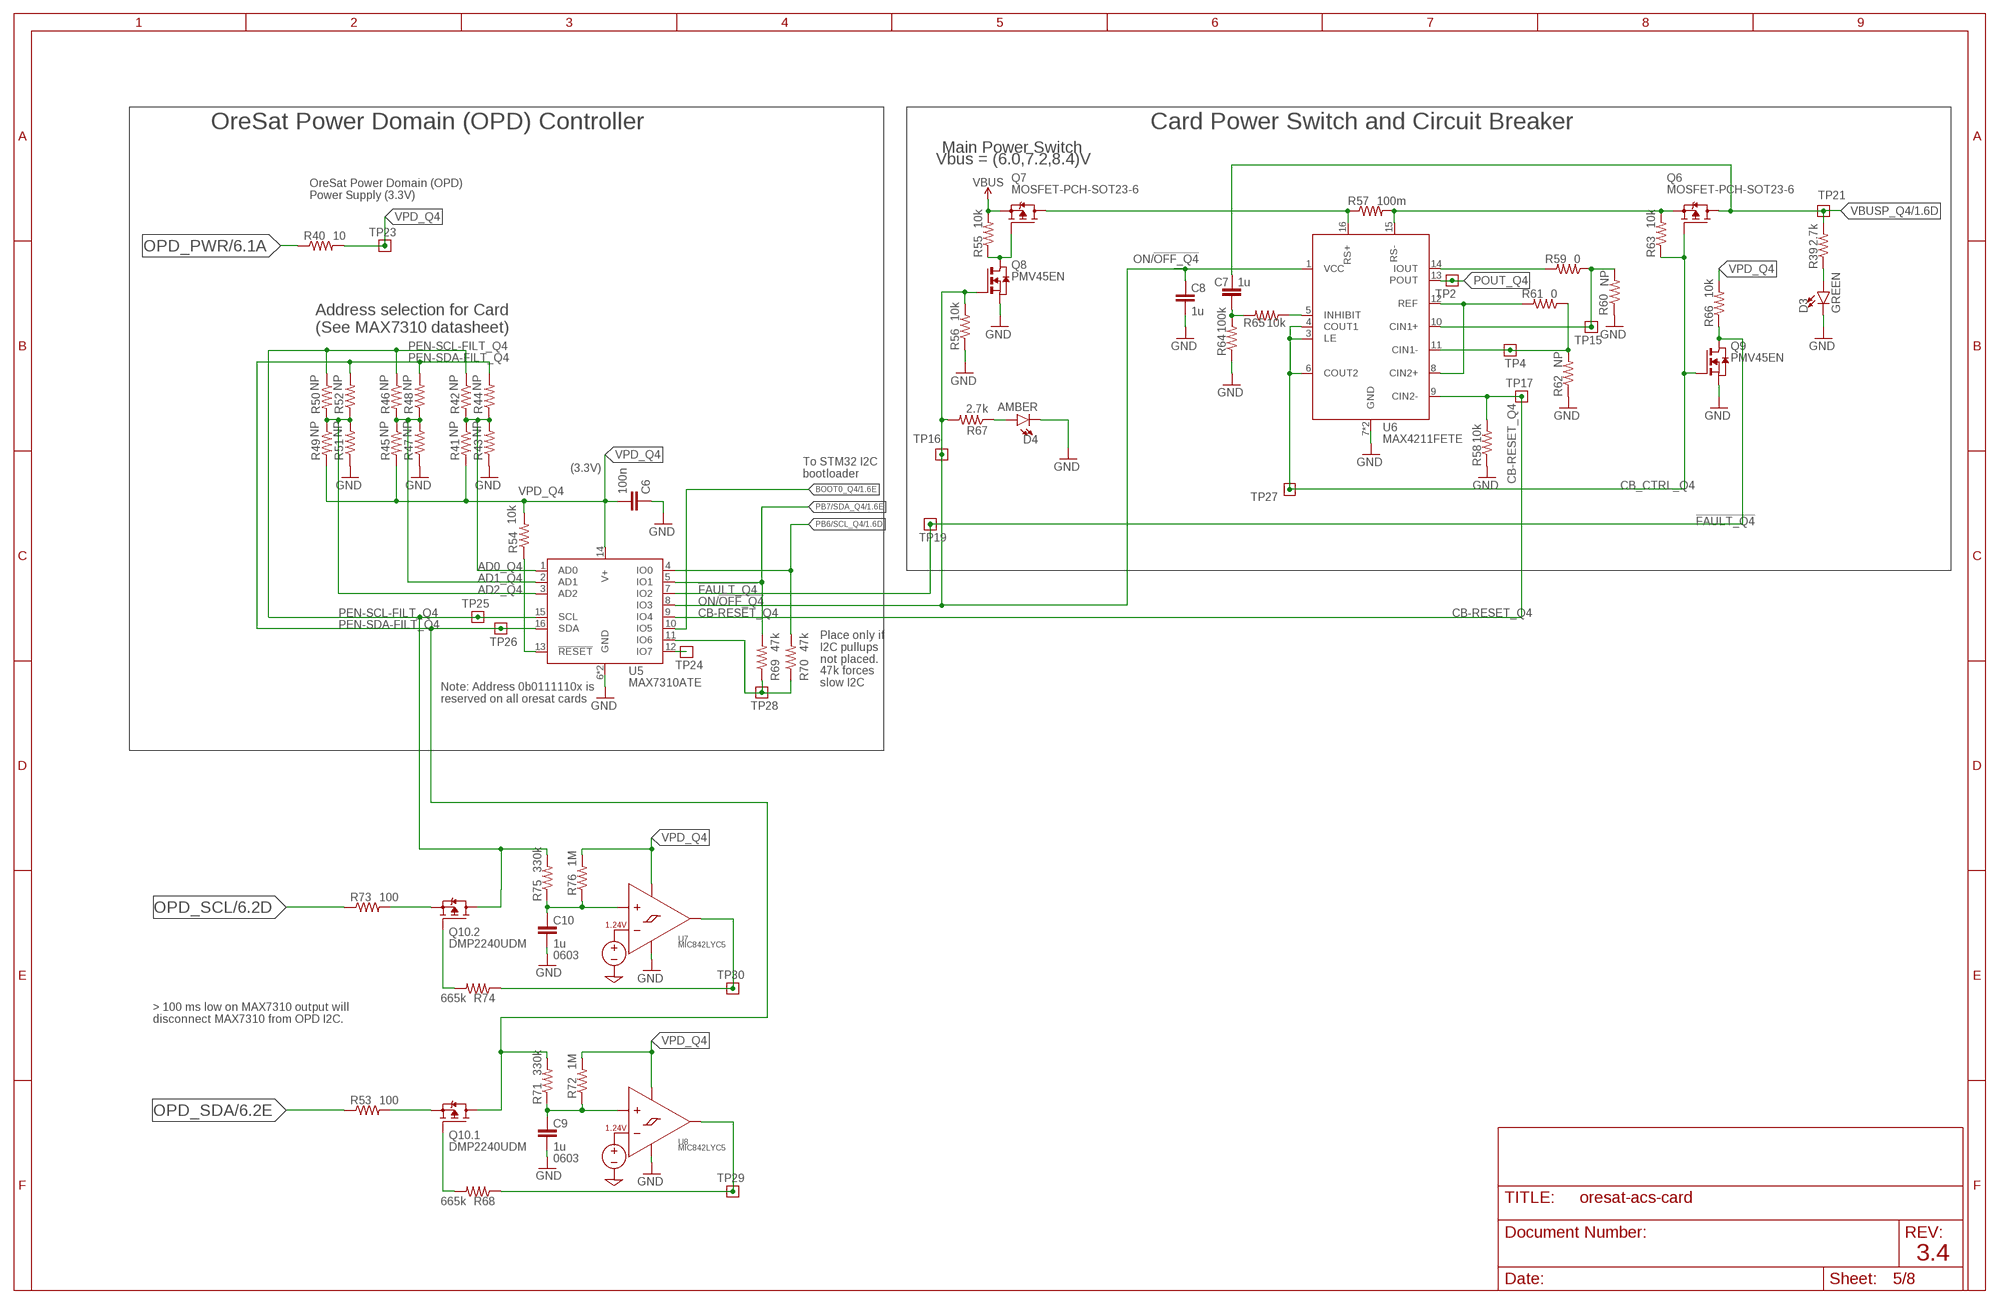
[diagram p4: schematic, sheet 5]

### Parts
C6  100n  C-EU0603-C-NOSILK  [.0603-C-NOSILK]
C7  1u  C-EU0603-C-NOSILK  [.0603-C-NOSILK]
C8  1u  C-EU0603-C-NOSILK  [.0603-C-NOSILK]
C9  1u  C-EU0603-C-NOSILK  [.0603-C-NOSILK]
C10  1u  C-EU0603-C-NOSILK  [.0603-C-NOSILK]
D3  GREEN  LED-GREEN0603  [LED-0603]
D4  AMBER  LED-GREEN0603  [LED-0603]
Q6  MOSFET-PCH-SOT23-6  [SOT23-6]
Q7  MOSFET-PCH-SOT23-6  [SOT23-6]
Q8  PMV45EN  [SOT23]
Q9  PMV45EN  [SOT23]
Q10  DMP2240UDM  MOSFET-PCH-SOT23-6  [SOT23-6]
R39  2.7k  R-US_0603-C-NOSILK  [.0603-C-NOSILK]
R40  10  R-US_0603-C-NOSILK  [.0603-C-NOSILK]
R41  NP  R-US_0603-C-NOSILK  [.0603-C-NOSILK]
R42  NP  R-US_0603-C-NOSILK  [.0603-C-NOSILK]
R43  NP  R-US_0603-C-NOSILK  [.0603-C-NOSILK]
R44  NP  R-US_0603-C-NOSILK  [.0603-C-NOSILK]
R45  NP  R-US_0603-C-NOSILK  [.0603-C-NOSILK]
R46  NP  R-US_0603-C-NOSILK  [.0603-C-NOSILK]
R47  NP  R-US_0603-C-NOSILK  [.0603-C-NOSILK]
R48  NP  R-US_0603-C-NOSILK  [.0603-C-NOSILK]
R49  NP  R-US_0603-C-NOSILK  [.0603-C-NOSILK]
R50  NP  R-US_0603-C-NOSILK  [.0603-C-NOSILK]
R51  NP  R-US_0603-C-NOSILK  [.0603-C-NOSILK]
R52  NP  R-US_0603-C-NOSILK  [.0603-C-NOSILK]
R53  100  R-US_0603-C-NOSILK  [.0603-C-NOSILK]
R54  10k  R-US_0603-C-NOSILK  [.0603-C-NOSILK]
R55  10k  R-US_0603-C-NOSILK  [.0603-C-NOSILK]
R56  10k  R-US_0603-C-NOSILK  [.0603-C-NOSILK]
R57  100m  R-US_R1206  [R1206]
R58  10k  R-US_0603-C-NOSILK  [.0603-C-NOSILK]
R59  0  R-US_0603-C-NOSILK  [.0603-C-NOSILK]
R60  NP  R-US_0603-C-NOSILK  [.0603-C-NOSILK]
R61  0  R-US_0603-C-NOSILK  [.0603-C-NOSILK]
R62  NP  R-US_0603-C-NOSILK  [.0603-C-NOSILK]
R63  10k  R-US_0603-C-NOSILK  [.0603-C-NOSILK]
R64  100k  R-US_0603-C-NOSILK  [.0603-C-NOSILK]
R65  10k  R-US_0603-C-NOSILK  [.0603-C-NOSILK]
R66  10k  R-US_0603-C-NOSILK  [.0603-C-NOSILK]
R67  2.7k  R-US_0603-C-NOSILK  [.0603-C-NOSILK]
R68  665k  R-US_0603-C-NOSILK  [.0603-C-NOSILK]
R69  47k  R-US_0603-C-NOSILK  [.0603-C-NOSILK]
R70  47k  R-US_0603-C-NOSILK  [.0603-C-NOSILK]
R71  330k  R-US_0603-C-NOSILK  [.0603-C-NOSILK]
R72  1M  R-US_0603-C-NOSILK  [.0603-C-NOSILK]
R73  100  R-US_0603-C-NOSILK  [.0603-C-NOSILK]
R74  665k  R-US_0603-C-NOSILK  [.0603-C-NOSILK]
R75  330k  R-US_0603-C-NOSILK  [.0603-C-NOSILK]
R76  1M  R-US_0603-C-NOSILK  [.0603-C-NOSILK]
TP2  TEST-POINT-LARGE-SQUARE  [1X01]
TP4  TEST-POINT-LARGE-SQUARE  [1X01]
TP15  TEST-POINT-LARGE-SQUARE  [1X01]
TP16  TEST-POINT-LARGE-SQUARE  [1X01]
TP17  TEST-POINT-LARGE-SQUARE  [1X01]
TP19  TEST-POINT-LARGE-SQUARE  [1X01]
TP21  TEST-POINT-LARGE-SQUARE  [1X01]
TP23  TEST-POINT-LARGE-SQUARE  [1X01]
TP24  TEST-POINT-LARGE-SQUARE  [1X01]
TP25  TEST-POINT-LARGE-SQUARE  [1X01]
TP26  TEST-POINT-LARGE-SQUARE  [1X01]
TP27  TEST-POINT-LARGE-SQUARE  [1X01]
TP28  TEST-POINT-LARGE-SQUARE  [1X01]
TP29  TEST-POINT-LARGE-SQUARE  [1X01]
TP30  TEST-POINT-LARGE-SQUARE  [1X01]
U5  MAX7310ATE  MAX7310  [QFN65P400X400X80-17T210]
U6  MAX4211FETE  MAX4211  [QFN65P400X400X80-17T210]
U7  MIC842LYC5  [SC70-5]
U8  MIC842LYC5  [SC70-5]

### Nets
!FAULT_Q4: Q9.3(D) R66.1 TP19.1 U5.7(IO2)
AD0_Q4: R41.1 R42.2 R43.2 R44.1 U5.1(AD0)
AD1_Q4: R45.1 R46.2 R47.2 R48.1 U5.2(AD1)
AD2_Q4: R49.1 R50.2 R51.2 R52.1 U5.3(AD2)
BOOT0_Q4: U5.10(IO5) ; also sheet 1
CB-RESET_Q4: R58.2 TP17.1 U5.9(IO4) U6.9(CIN2-)
CB_CTRL_Q4: Q6.3(G) Q9.1(G) R63.1 TP27.1 U6.3(LE) U6.4(COUT1) U6.6(COUT2)
GND: C6.1 C8.2 C9.2 C10.2 D3.C D4.C Q8.2(S) Q9.2(S) R43.1 R47.1 R51.1 R56.1 R58.1 R60.1 R62.1 R64.1 U5.6(GND) U5.EPAD(GND) U6.7(GND) U6.EPAD(GND) U7.2(GND) U8.2(GND) ; also sheet 1,2,3,4,6,7,8
IOUT_Q4: R59.2 U6.14(IOUT)
N$5: D3.A R39.1
N$6: R54.1 U5.13(!RESET)
N$7: Q7.3(G) Q8.3(D) R55.1
N$8: Q7.1(D) Q7.2(D) Q7.5(D) Q7.6(D) R57.1 U6.16(RS+)
N$9: R59.1 R60.2 TP15.1 U6.10(CIN1+)
N$10: R61.1 R62.2 TP4.1 U6.11(CIN1-)
N$11: R61.2 U6.8(CIN2+) U6.12(REF)
N$12: R65.1 U6.5(INHIBIT)
N$13: C7.1 R64.2 R65.2
N$14: Q6.4(S) R57.2 R63.2 U6.15(RS-)
N$15: D4.A R67.1
N$16: Q10.5(.1:S) R53.2
N$17: R68.1 TP29.1 U8.4(OUT)
N$18: R69.1 R70.1 TP28.1 U5.11(IO6)
N$19: Q10.2(.2:S) R73.2
N$20: R74.1 TP30.1 U7.4(OUT)
N$21: C10.1 R75.1 R76.1 U7.1(INP)
N$22: C9.1 R71.1 R72.1 U8.1(INP)
N$23: TP24.1 U5.12(IO7)
N$26: Q10.3(.2:G) R74.2
N$27: Q10.1(.1:G) R68.2
ON/!OFF_Q4: C8.1 Q8.1(G) R56.2 R67.2 TP16.1 U5.8(IO3) U6.1(VCC)
OPD_PWR: R40.1 ; also sheet 1,2,3,4,6
OPD_SCL: R73.1 ; also sheet 1,2,3,4,6
OPD_SDA: R53.1 ; also sheet 1,2,3,4,6
PB6/SCL_Q4: R70.2 U5.4(IO0) ; also sheet 1
PB7/SDA_Q4: R69.2 U5.5(IO1) ; also sheet 1
PEN-SCL-FILT_Q4: Q10.4(.2:D) R42.1 R46.1 R50.1 R75.2 TP25.1 U5.15(SCL)
PEN-SDA-FILT_Q4: Q10.6(.1:D) R44.2 R48.2 R52.2 R71.2 TP26.1 U5.16(SDA)
POUT_Q4: TP2.1 U6.13(POUT)
VBUS: Q7.4(S) R55.2 ; also sheet 1,2,3,4,6
VBUSP_Q4: C7.2 Q6.1(D) Q6.2(D) Q6.5(D) Q6.6(D) R39.2 TP21.1 ; also sheet 1
VPD_Q4: C6.2 R40.2 R41.2 R45.2 R49.2 R54.2 R66.2 R72.2 R76.2 TP23.1 U5.14(V+) U7.5(VDD) U8.5(VDD)

### Notes on the sheet
- OreSat Power Domain (OPD) Controller | Card Power Switch and Circuit Breaker
- Main Power Switch
- Vbus = (6.0,7.2,8.4)V
- OreSat Power Domain (OPD)
  Power Supply (3.3V)
- Address selection for Card
  (See MAX7310 datasheet)
- (3.3V)
- To STM32 I2C
  bootloader
- Place only if
  I2C pullups
  not placed.
- 47k forces
  slow I2C
- Note: Address 0b0111110x is 
  reserved on all oresat cards
- 0603
- > 100 ms low on MAX7310 output will
  disconnect MAX7310 from OPD I2C.
- 0603
- 3.4

## Sheet 6 of 8: Sensor Power Domain
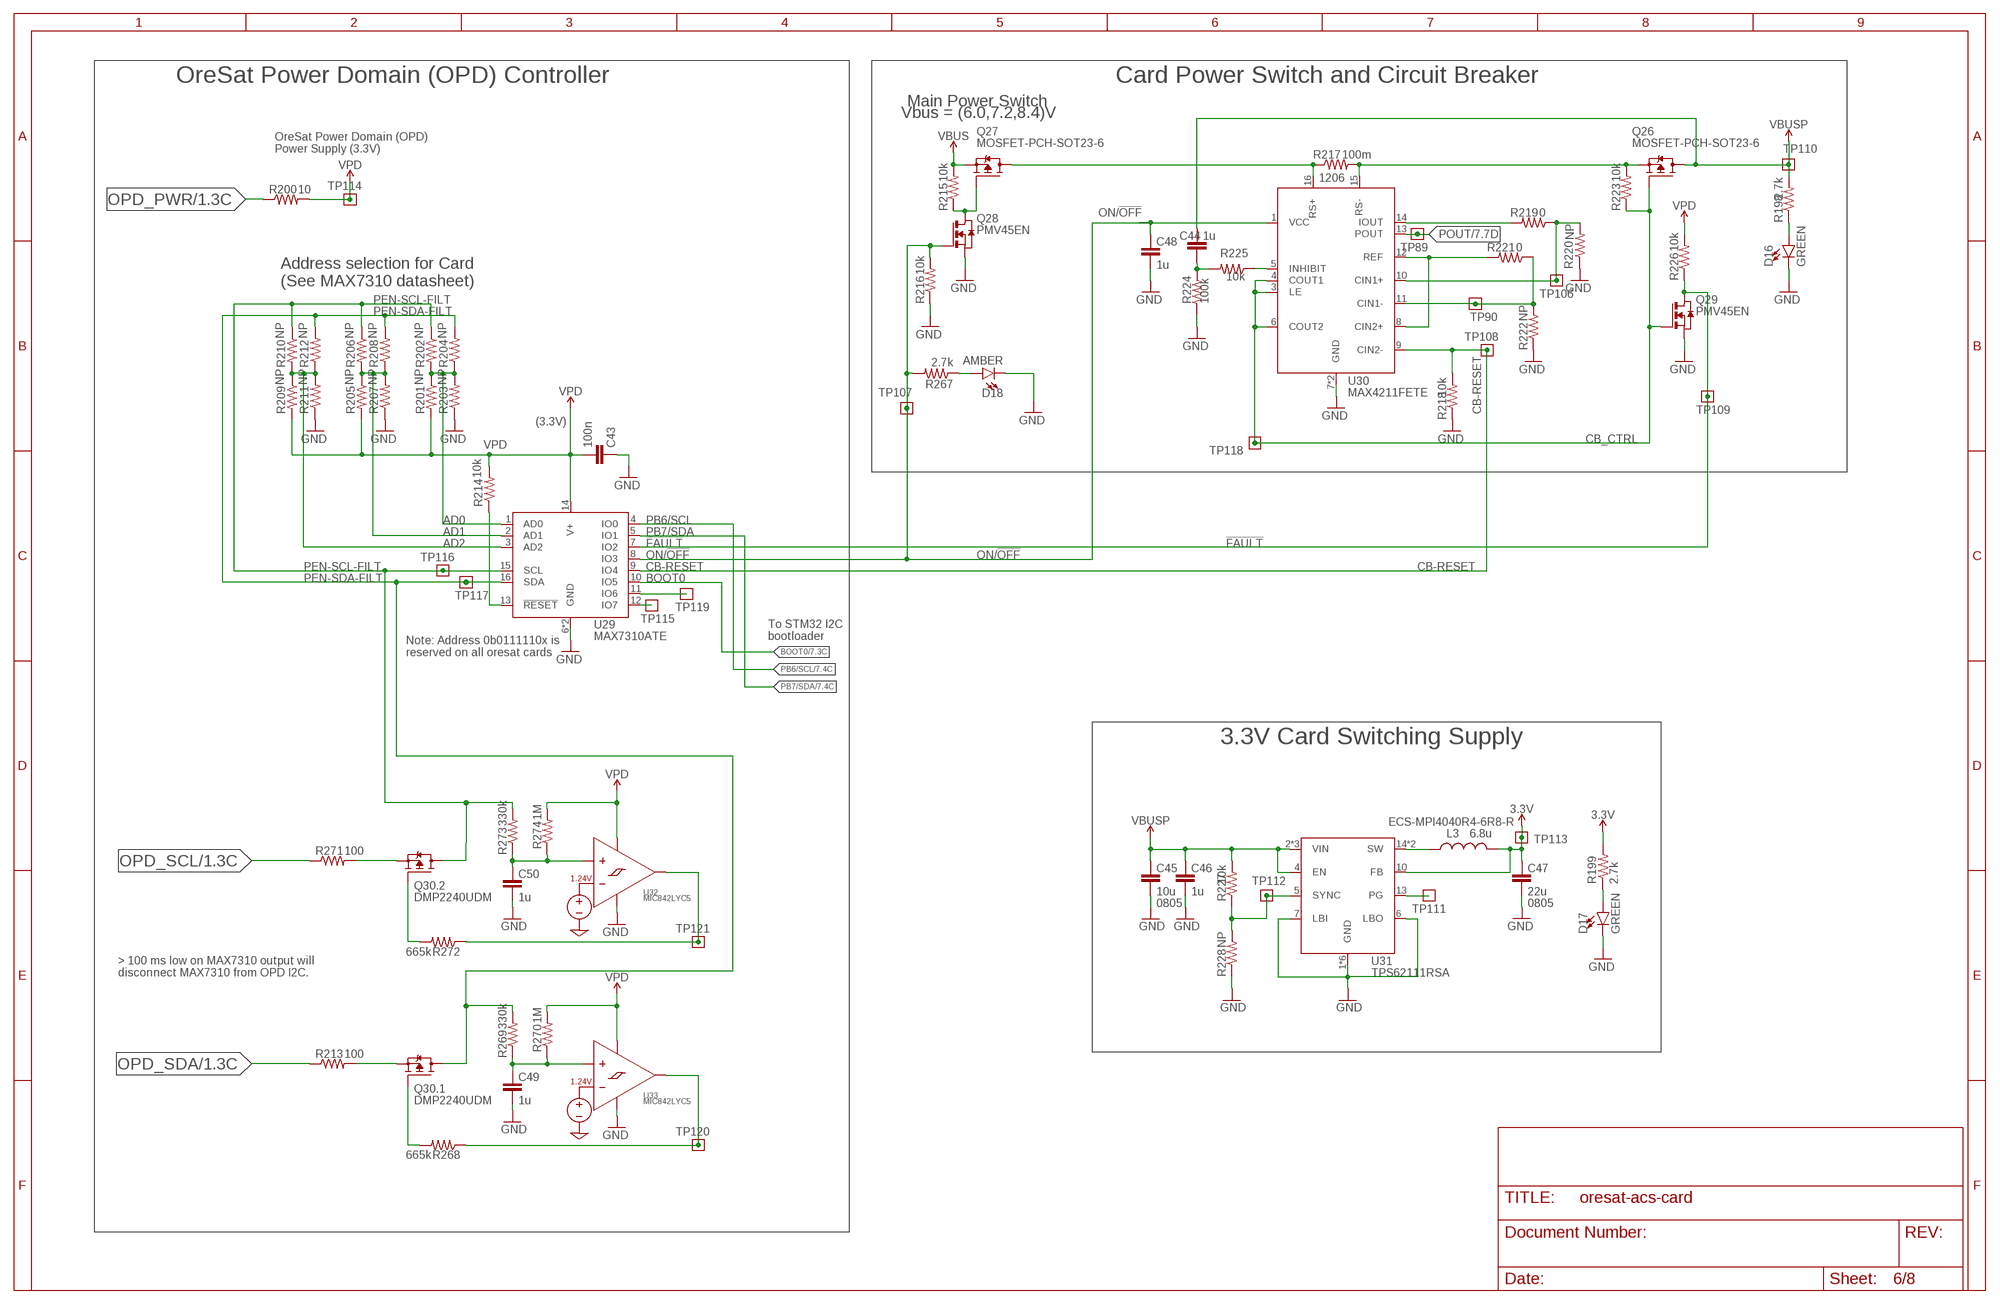
[diagram p5: schematic, sheet 6]

### Parts
C43  100n  C-EU0603-C-NOSILK  [.0603-C-NOSILK]
C44  1u  C-EU0603-C-NOSILK  [.0603-C-NOSILK]
C45  10u  C-EU0805-B-NOSILK  [.0805-B-NOSILK]
C46  1u  C-EU0603-C-NOSILK  [.0603-C-NOSILK]
C47  22u  C-EU0805-B-NOSILK  [.0805-B-NOSILK]
C48  1u  C-EU0603-C-NOSILK  [.0603-C-NOSILK]
C49  1u  C-EU0603-C-NOSILK  [.0603-C-NOSILK]
C50  1u  C-EU0603-C-NOSILK  [.0603-C-NOSILK]
D16  GREEN  LED-GREEN0603  [LED-0603]
D17  GREEN  LED-GREEN0603  [LED-0603]
D18  AMBER  LED-GREEN0603  [LED-0603]
L3  6.8u  L-ECS-MPI4040  [ECS-MPI4040]
Q26  MOSFET-PCH-SOT23-6  [SOT23-6]
Q27  MOSFET-PCH-SOT23-6  [SOT23-6]
Q28  PMV45EN  [SOT23]
Q29  PMV45EN  [SOT23]
Q30  DMP2240UDM  MOSFET-PCH-SOT23-6  [SOT23-6]
R198  2.7k  R-US_0603-C-NOSILK  [.0603-C-NOSILK]
R199  2.7k  R-US_0603-C-NOSILK  [.0603-C-NOSILK]
R200  10  R-US_0603-C-NOSILK  [.0603-C-NOSILK]
R201  NP  R-US_0603-C-NOSILK  [.0603-C-NOSILK]
R202  NP  R-US_0603-C-NOSILK  [.0603-C-NOSILK]
R203  NP  R-US_0603-C-NOSILK  [.0603-C-NOSILK]
R204  NP  R-US_0603-C-NOSILK  [.0603-C-NOSILK]
R205  NP  R-US_0603-C-NOSILK  [.0603-C-NOSILK]
R206  NP  R-US_0603-C-NOSILK  [.0603-C-NOSILK]
R207  NP  R-US_0603-C-NOSILK  [.0603-C-NOSILK]
R208  NP  R-US_0603-C-NOSILK  [.0603-C-NOSILK]
R209  NP  R-US_0603-C-NOSILK  [.0603-C-NOSILK]
R210  NP  R-US_0603-C-NOSILK  [.0603-C-NOSILK]
R211  NP  R-US_0603-C-NOSILK  [.0603-C-NOSILK]
R212  NP  R-US_0603-C-NOSILK  [.0603-C-NOSILK]
R213  100  R-US_0603-C-NOSILK  [.0603-C-NOSILK]
R214  10k  R-US_0603-C-NOSILK  [.0603-C-NOSILK]
R215  10k  R-US_0603-C-NOSILK  [.0603-C-NOSILK]
R216  10k  R-US_0603-C-NOSILK  [.0603-C-NOSILK]
R217  100m  R-US_R1206  [R1206]
R218  10k  R-US_0603-C-NOSILK  [.0603-C-NOSILK]
R219  0  R-US_0603-C-NOSILK  [.0603-C-NOSILK]
R220  NP  R-US_0603-C-NOSILK  [.0603-C-NOSILK]
R221  0  R-US_0603-C-NOSILK  [.0603-C-NOSILK]
R222  NP  R-US_0603-C-NOSILK  [.0603-C-NOSILK]
R223  10k  R-US_0603-C-NOSILK  [.0603-C-NOSILK]
R224  100k  R-US_0603-C-NOSILK  [.0603-C-NOSILK]
R225  10k  R-US_0603-C-NOSILK  [.0603-C-NOSILK]
R226  10k  R-US_0603-C-NOSILK  [.0603-C-NOSILK]
R227  10k  R-US_0603-C-NOSILK  [.0603-C-NOSILK]
R228  NP  R-US_0603-C-NOSILK  [.0603-C-NOSILK]
R267  2.7k  R-US_0603-C-NOSILK  [.0603-C-NOSILK]
R268  665k  R-US_0603-C-NOSILK  [.0603-C-NOSILK]
R269  330k  R-US_0603-C-NOSILK  [.0603-C-NOSILK]
R270  1M  R-US_0603-C-NOSILK  [.0603-C-NOSILK]
R271  100  R-US_0603-C-NOSILK  [.0603-C-NOSILK]
R272  665k  R-US_0603-C-NOSILK  [.0603-C-NOSILK]
R273  330k  R-US_0603-C-NOSILK  [.0603-C-NOSILK]
R274  1M  R-US_0603-C-NOSILK  [.0603-C-NOSILK]
TP89  TEST-POINT-LARGE-SQUARE  [1X01]
TP90  TEST-POINT-LARGE-SQUARE  [1X01]
TP106  TEST-POINT-LARGE-SQUARE  [1X01]
TP107  TEST-POINT-LARGE-SQUARE  [1X01]
TP108  TEST-POINT-LARGE-SQUARE  [1X01]
TP109  TEST-POINT-LARGE-SQUARE  [1X01]
TP110  TEST-POINT-LARGE-SQUARE  [1X01]
TP111  TEST-POINT-LARGE-SQUARE  [1X01]
TP112  TEST-POINT-LARGE-SQUARE  [1X01]
TP113  TEST-POINT-LARGE-SQUARE  [1X01]
TP114  TEST-POINT-LARGE-SQUARE  [1X01]
TP115  TEST-POINT-LARGE-SQUARE  [1X01]
TP116  TEST-POINT-LARGE-SQUARE  [1X01]
TP117  TEST-POINT-LARGE-SQUARE  [1X01]
TP118  TEST-POINT-LARGE-SQUARE  [1X01]
TP119  TEST-POINT-LARGE-SQUARE  [1X01]
TP120  TEST-POINT-LARGE-SQUARE  [1X01]
TP121  TEST-POINT-LARGE-SQUARE  [1X01]
U29  MAX7310ATE  MAX7310  [QFN65P400X400X80-17T210]
U30  MAX4211FETE  MAX4211  [QFN65P400X400X80-17T210]
U31  TPS62111RSA  TPS6211X  [S-PVQFN-16]
U32  MIC842LYC5  [SC70-5]
U33  MIC842LYC5  [SC70-5]

### Nets
3.3V: C47.1 L3.2 R199.2 TP113.1 U31.10(FB) ; also sheet 7,8
!FAULT: Q29.3(D) R226.1 TP109.1 U29.7(IO2)
AD0: R201.1 R202.2 R203.2 R204.1 U29.1(AD0)
AD1: R205.1 R206.2 R207.2 R208.1 U29.2(AD1)
AD2: R209.1 R210.2 R211.2 R212.1 U29.3(AD2)
BOOT0: U29.10(IO5) ; also sheet 7
CB-RESET: R218.2 TP108.1 U29.9(IO4) U30.9(CIN2-)
CB_CTRL: Q26.3(G) Q29.1(G) R223.1 TP118.1 U30.3(LE) U30.4(COUT1) U30.6(COUT2)
GND: C43.1 C45.2 C46.2 C47.2 C48.2 C49.2 C50.2 D16.C D17.C D18.C Q28.2(S) Q29.2(S) R203.1 R207.1 R211.1 R216.1 R218.1 R220.1 R222.1 R224.1 R228.1 U29.6(GND) U29.EPAD(GND) U30.7(GND) U30.EPAD(GND) U31.1(GND) U31.6(LBO) U31.7(LBI) U31.9(GND) U31.11(GND) U31.12(GND) U31.16(GND) U31.PAD(GND) U32.2(GND) U33.2(GND) ; also sheet 1,2,3,4,5,7,8
IOUT2: R219.2 U30.14(IOUT)
N$44: Q30.3(.2:G) R272.2
N$46: Q30.1(.1:G) R268.2
N$56: D16.A R198.1
N$58: D17.A R199.1
N$59: R214.1 U29.13(!RESET)
N$61: Q27.3(G) Q28.3(D) R215.1
N$62: Q27.1(D) Q27.2(D) Q27.5(D) Q27.6(D) R217.1 U30.16(RS+)
N$63: R219.1 R220.2 TP106.1 U30.10(CIN1+)
N$64: R221.1 R222.2 TP90.1 U30.11(CIN1-)
N$65: R221.2 U30.8(CIN2+) U30.12(REF)
N$66: R225.1 U30.5(INHIBIT)
N$67: C44.1 R224.2 R225.2
N$68: Q26.4(S) R217.2 R223.2 U30.15(RS-)
N$69: D18.A R267.1
N$70: Q30.5(.1:S) R213.2
N$71: R268.1 TP120.1 U33.4(OUT)
N$72: TP119.1 U29.11(IO6)
N$73: Q30.2(.2:S) R271.2
N$74: R272.1 TP121.1 U32.4(OUT)
N$75: C50.1 R273.1 R274.1 U32.1(INP)
N$76: C49.1 R269.1 R270.1 U33.1(INP)
N$77: TP115.1 U29.12(IO7)
ON/!OFF: C48.1 Q28.1(G) R216.2 R267.2 TP107.1 U29.8(IO3) U30.1(VCC)
OPD_PWR: R200.1 ; also sheet 1,2,3,4,5
OPD_SCL: R271.1 ; also sheet 1,2,3,4,5
OPD_SDA: R213.1 ; also sheet 1,2,3,4,5
PB6/SCL: U29.4(IO0) ; also sheet 7,8
PB7/SDA: U29.5(IO1) ; also sheet 7,8
PEN-SCL-FILT: Q30.4(.2:D) R202.1 R206.1 R210.1 R273.2 TP116.1 U29.15(SCL)
PEN-SDA-FILT: Q30.6(.1:D) R204.2 R208.2 R212.2 R269.2 TP117.1 U29.16(SDA)
POUT: TP89.1 U30.13(POUT) ; also sheet 7
TPS62111-PG2: TP111.1 U31.13(PG)
TPS62111-SYNC2: R227.1 R228.2 TP112.1 U31.5(SYNC)
TPS62111_SW2: L3.1 U31.14(SW) U31.15(SW)
VBUS: Q27.4(S) R215.2 ; also sheet 1,2,3,4,5
VBUSP: C44.2 C45.1 C46.1 Q26.1(D) Q26.2(D) Q26.5(D) Q26.6(D) R198.2 R227.2 TP110.1 U31.2(VIN) U31.3(VIN) U31.4(EN) U31.8(VIN) ; also sheet 7
VPD: C43.2 R200.2 R201.2 R205.2 R209.2 R214.2 R226.2 R270.2 R274.2 TP114.1 U29.14(V+) U32.5(VDD) U33.5(VDD)

### Notes on the sheet
- OreSat Power Domain (OPD) Controller | Card Power Switch and Circuit Breaker
- Main Power Switch
- Vbus = (6.0,7.2,8.4)V
- OreSat Power Domain (OPD)
  Power Supply (3.3V)
- 1206
- Address selection for Card
  (See MAX7310 datasheet)
- (3.3V)
- To STM32 I2C
  bootloader
- Note: Address 0b0111110x is 
  reserved on all oresat cards
- 3.3V Card Switching Supply
- ECS-MPI4040R4-6R8-R
- 0805 | 0805
- > 100 ms low on MAX7310 output will
  disconnect MAX7310 from OPD I2C.

## Sheet 7 of 8: Microcontroller
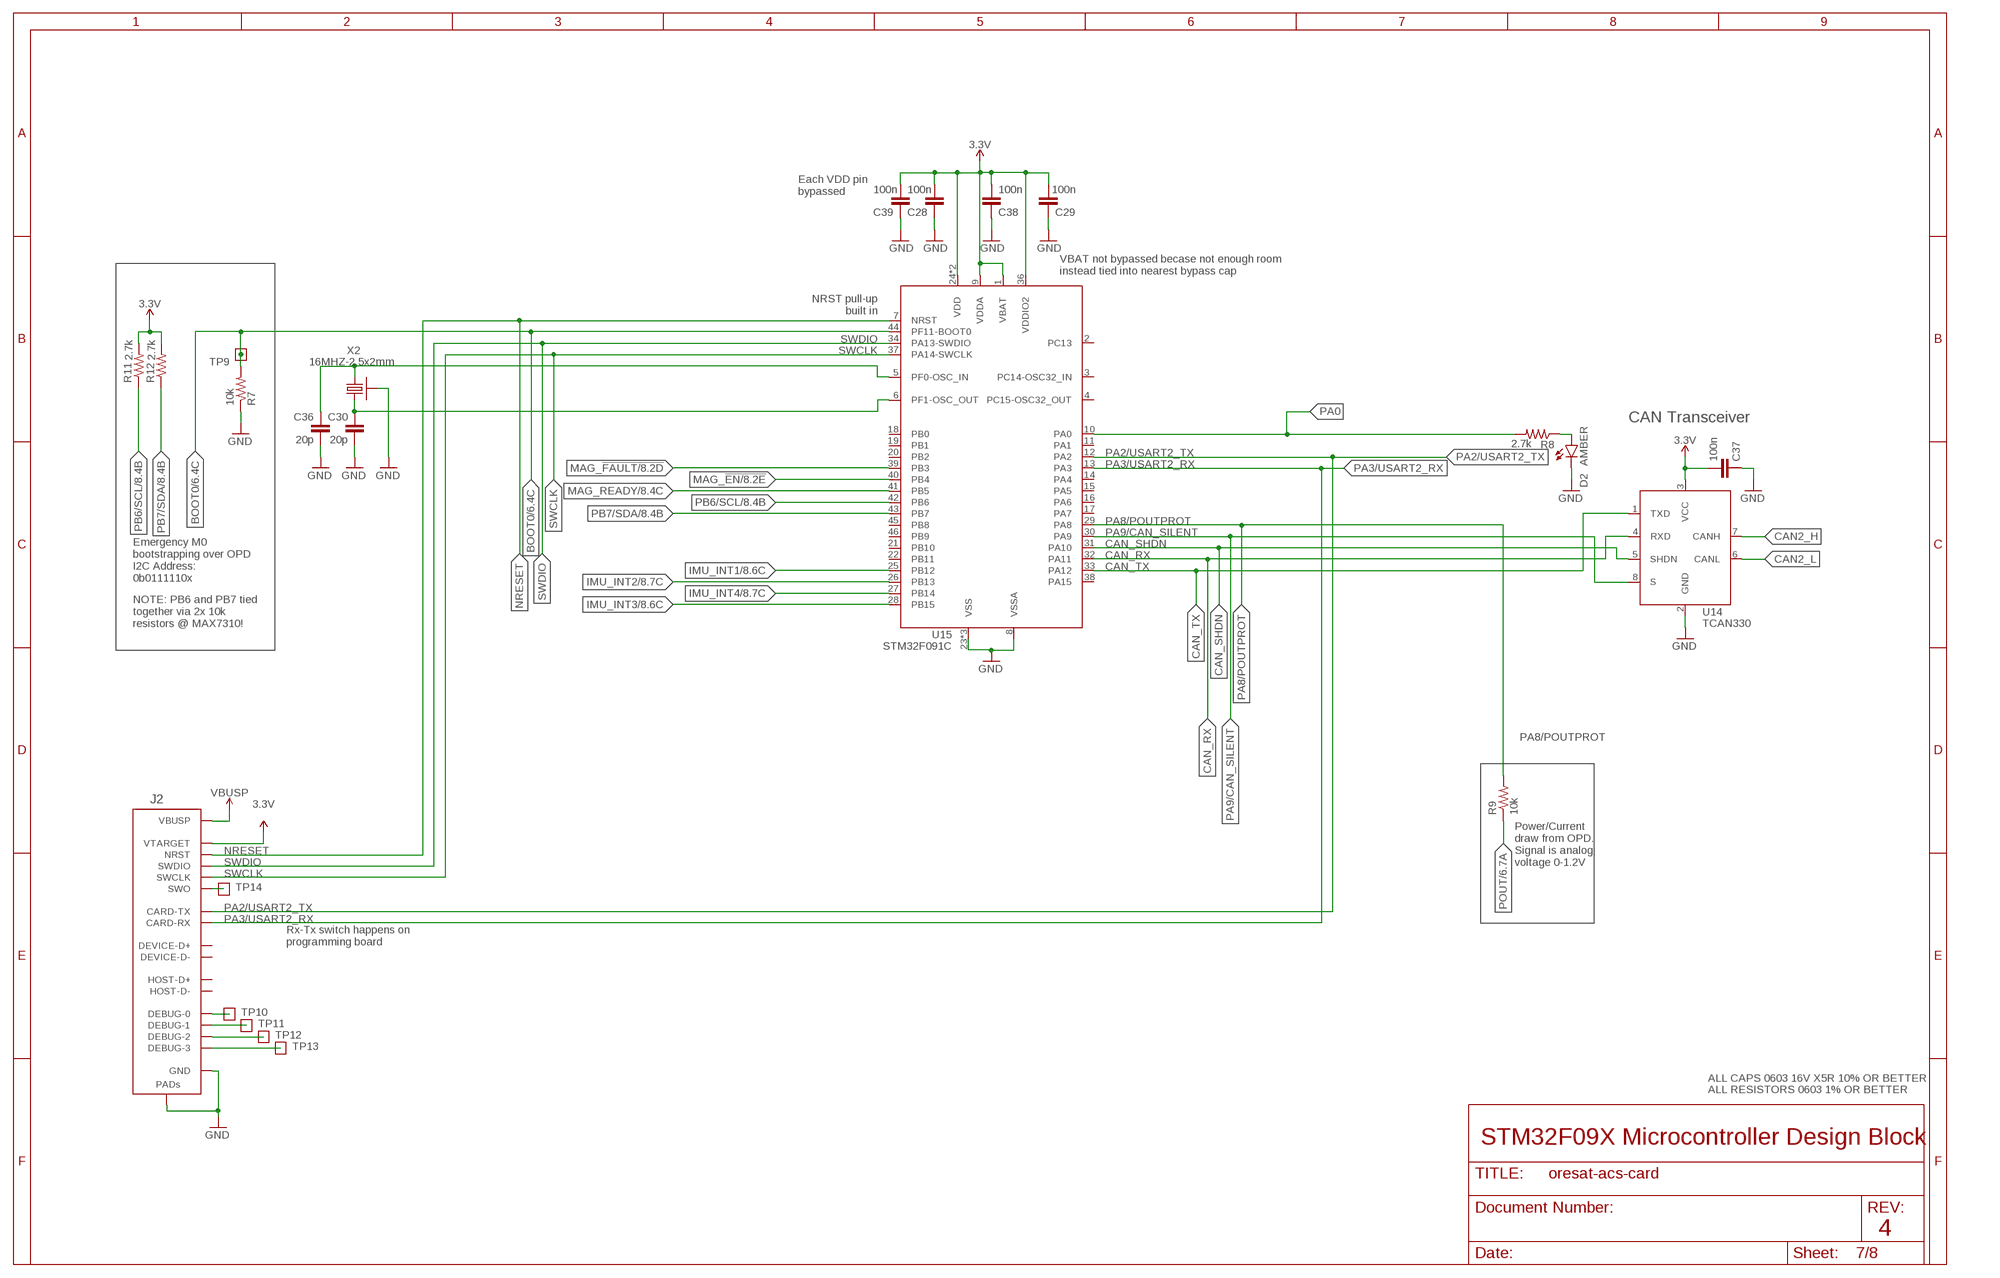
[diagram p6: schematic, sheet 7]

### Parts
C28  100n  C-EU0603-C-NOSILK  [.0603-C-NOSILK]
C29  100n  C-EU0603-C-NOSILK  [.0603-C-NOSILK]
C30  20p  C-EU0603-C-NOSILK  [.0603-C-NOSILK]
C36  20p  C-EU0603-C-NOSILK  [.0603-C-NOSILK]
C37  100n  C-EU0603-C-NOSILK  [.0603-C-NOSILK]
C38  100n  C-EU0603-C-NOSILK  [.0603-C-NOSILK]
C39  100n  C-EU0603-C-NOSILK  [.0603-C-NOSILK]
D2  AMBER  LED-GREEN0603  [LED-0603]
J2  ORESAT-DEBUG-CONNECTOR-SOLAR  [WURTH_687120183622]
R7  10k  R-US_0603-C-NOSILK  [.0603-C-NOSILK]
R8  2.7k  R-US_0603-C-NOSILK  [.0603-C-NOSILK]
R9  10k  R-US_0603-C-NOSILK  [.0603-C-NOSILK]
R11  2.7k  R-US_0603-C-NOSILK  [.0603-C-NOSILK]
R12  2.7k  R-US_0603-C-NOSILK  [.0603-C-NOSILK]
TP9  TEST-POINT-LARGE-SQUARE  [1X01]
TP10  TEST-POINT-LARGE-SQUARE  [1X01]
TP11  TEST-POINT-LARGE-SQUARE  [1X01]
TP12  TEST-POINT-LARGE-SQUARE  [1X01]
TP13  TEST-POINT-LARGE-SQUARE  [1X01]
TP14  TEST-POINT-LARGE-SQUARE  [1X01]
U14  TCAN330  [SOT23-8_TI-DCN]
U15  STM32F091C  [STM32F091C]
X2  16MHZ-2.5x2mm  CRYSTAL-WITH-GND  [CRYSTAL_2.5X2]

### Nets
3.3V: C28.2 C29.2 C37.2 C38.2 C39.2 J2.11(VTARGET) R11.2 R12.2 U14.3(VCC) U15.1(VBAT) U15.9(VDDA) U15.24(VDD) U15.36(VDDIO2) U15.48(VDD) ; also sheet 6,8
BOOT0: R7.2 TP9.1 U15.44(PF11-BOOT0) ; also sheet 6
CAN2_H: U14.7(CANH) ; also sheet 1
CAN2_L: U14.6(CANL) ; also sheet 1
CAN_RX: U14.4(RXD) U15.32(PA11)
CAN_SHDN: U14.5(SHDN) U15.31(PA10)
CAN_TX: U14.1(TXD) U15.33(PA12)
CRYSTALIN1: C36.1 U15.5(PF0-OSC_IN) X2.1
CRYSTALOUT1: C30.1 U15.6(PF1-OSC_OUT) X2.3
GND: C28.1 C29.1 C30.2 C36.2 C37.1 C38.1 C39.1 D2.C J2.3(GND) J2.6(GND) J2.9(GND) J2.PAD1(PAD) J2.PAD2(PAD) R7.1 U14.2(GND) U15.8(VSSA) U15.23(VSS) U15.35(VSS) U15.47(VSS) X2.2(SHIELD) X2.4(SHIELD) ; also sheet 1,2,3,4,5,6,8
IMU_INT1: U15.25(PB12) ; also sheet 8
IMU_INT2: U15.26(PB13) ; also sheet 8
IMU_INT3: U15.28(PB15) ; also sheet 8
IMU_INT4: U15.27(PB14) ; also sheet 8
MAG_!EN: U15.40(PB4) ; also sheet 8
MAG_!FAULT: U15.39(PB3) ; also sheet 8
MAG_READY: U15.41(PB5) ; also sheet 8
N$31: D2.A R8.1
N$32: J2.20(DEBUG-3) TP13.1
N$33: J2.19(DEBUG-2) TP12.1
N$34: J2.18(DEBUG-1) TP11.1
N$35: J2.17(DEBUG-0) TP10.1
N$37: J2.16(SWO) TP14.1
NRESET: J2.10(NRST) U15.7(NRST)
PA0: R8.2 U15.10(PA0)
PA2/USART2_TX: J2.13(CARD-TX) U15.12(PA2)
PA3/USART2_RX: J2.12(CARD-RX) U15.13(PA3)
PA8/POUTPROT: R9.2 U15.29(PA8)
PA9/CAN_SILENT: U14.8(S) U15.30(PA9)
PB6/SCL: R11.1 U15.42(PB6) ; also sheet 6,8
PB7/SDA: R12.1 U15.43(PB7) ; also sheet 6,8
POUT: R9.1 ; also sheet 6
SWCLK: J2.15(SWCLK) U15.37(PA14-SWCLK)
SWDIO: J2.14(SWDIO) U15.34(PA13-SWDIO)
VBUSP: J2.1(VBUSP) J2.2(VBUSP) ; also sheet 6
Unconnected: J2.4(DEVICE-D+) J2.5(DEVICE-D-) J2.7(HOST-D+) J2.8(HOST-D-) U15.2(PC13) U15.3(PC14-OSC32_IN) U15.4(PC15-OSC32_OUT) U15.11(PA1) U15.14(PA4) U15.15(PA5) U15.16(PA6) U15.17(PA7) U15.18(PB0) U15.19(PB1) U15.20(PB2) U15.21(PB10) U15.22(PB11) U15.38(PA15) U15.45(PB8) U15.46(PB9)

### Notes on the sheet
- Each VDD pin
  bypassed
- VBAT not bypassed becase not enough room
  instead tied into nearest bypass cap
- NRST pull-up
  built in
- CAN Transceiver
- Emergency M0 
  bootstrapping over OPD 
  I2C Address: 
  0b0111110x
- NOTE: PB6 and PB7 tied
  together via 2x 10k
  resistors @ MAX7310!
- Power/Current 
  draw from OPD.
  Signal is analog 
  voltage 0-1.2V
- Rx-Tx switch happens on 
  programming board
- ALL CAPS 0603 16V X5R 10% OR BETTER
- ALL RESISTORS 0603 1% OR BETTER
- STM32F09X Microcontroller Design Block
- 4

## Sheet 8 of 8: Sensors
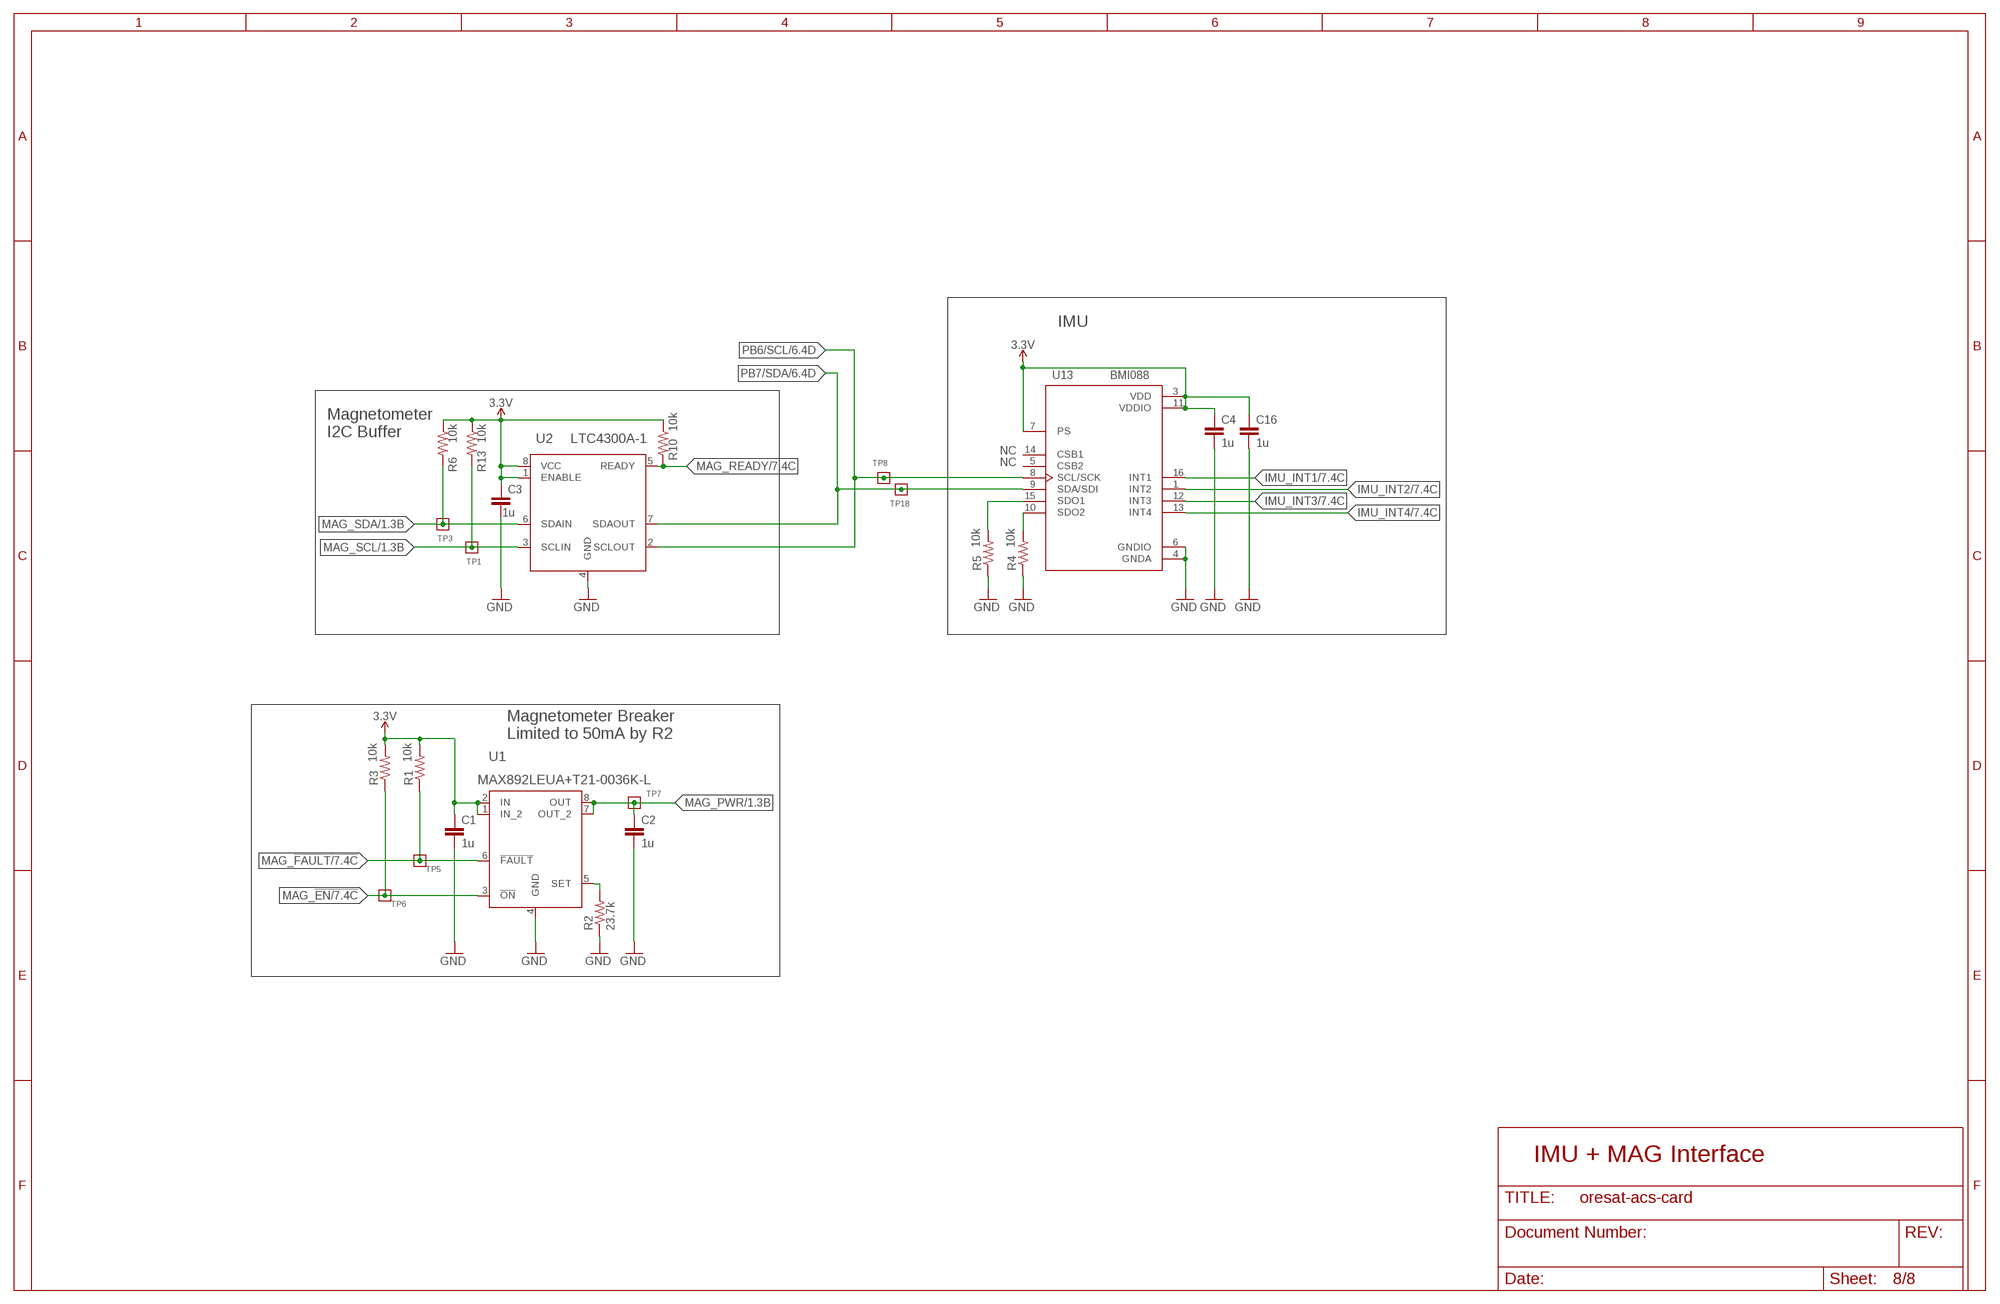
[diagram p7: schematic, sheet 8]

### Parts
C1  1u  C-EU0603-C-NOSILK  [.0603-C-NOSILK]
C2  1u  C-EU0603-C-NOSILK  [.0603-C-NOSILK]
C3  1u  C-EU0603-C-NOSILK  [.0603-C-NOSILK]
C4  1u  C-EU0603-C-NOSILK  [.0603-C-NOSILK]
C16  1u  C-EU0603-C-NOSILK  [.0603-C-NOSILK]
R1  10k  R-US_0603-C-NOSILK  [.0603-C-NOSILK]
R2  23.7k  R-US_0603-C-NOSILK  [.0603-C-NOSILK]
R3  10k  R-US_0603-C-NOSILK  [.0603-C-NOSILK]
R4  10k  R-US_0603-C-NOSILK  [.0603-C-NOSILK]
R5  10k  R-US_0603-C-NOSILK  [.0603-C-NOSILK]
R6  10k  R-US_0603-C-NOSILK  [.0603-C-NOSILK]
R10  10k  R-US_0603-C-NOSILK  [.0603-C-NOSILK]
R13  10k  R-US_0603-C-NOSILK  [.0603-C-NOSILK]
TP1  TEST-POINT-LARGE-SQUARE  [1X01]
TP3  TEST-POINT-LARGE-SQUARE  [1X01]
TP5  TEST-POINT-LARGE-SQUARE  [1X01]
TP6  TEST-POINT-LARGE-SQUARE  [1X01]
TP7  TEST-POINT-LARGE-SQUARE  [1X01]
TP8  TEST-POINT-LARGE-SQUARE  [1X01]
TP18  TEST-POINT-LARGE-SQUARE  [1X01]
U1  MAX892LEUA+T21-0036K-L  [21-0036K-L]
U2  LTC4300A-1  [MS8]
U13  BMI088  [PQFN50P450X300X100-16N]

### Nets
3.3V: C1.1 C3.1 C4.1 C16.1 R1.2 R3.2 R6.1 R10.1 R13.1 U1.1(IN_2) U1.2(IN) U2.1(ENABLE) U2.8(VCC) U13.3(VDD) U13.7(PS) U13.11(VDDIO) ; also sheet 6,7
GND: C1.2 C2.2 C3.2 C4.2 C16.2 R2.1 R4.1 R5.1 U1.4(GND) U2.4(GND) U13.4(GNDA) U13.6(GNDIO) ; also sheet 1,2,3,4,5,6,7
IMU_INT1: U13.16(INT1) ; also sheet 7
IMU_INT2: U13.1(INT2) ; also sheet 7
IMU_INT3: U13.12(INT3) ; also sheet 7
IMU_INT4: U13.13(INT4) ; also sheet 7
MAG_!EN: R3.1 TP6.1 U1.3(!ON) ; also sheet 7
MAG_!FAULT: R1.1 TP5.1 U1.6(!FAULT) ; also sheet 7
MAG_PWR: C2.1 TP7.1 U1.7(OUT_2) U1.8(OUT) ; also sheet 1
MAG_READY: R10.2 U2.5(READY) ; also sheet 7
MAG_SCL: R13.2 TP1.1 U2.3(SCLIN) ; also sheet 1
MAG_SDA: R6.2 TP3.1 U2.6(SDAIN) ; also sheet 1
N$1: R4.2 U13.10(SDO2)
N$24: R5.2 U13.15(SDO1)
N$25: R2.2 U1.5(SET)
PB6/SCL: TP8.1 U2.2(SCLOUT) U13.8(SCL/SCK) ; also sheet 6,7
PB7/SDA: TP18.1 U2.7(SDAOUT) U13.9(SDA/SDI) ; also sheet 6,7
Unconnected: U13.5(CSB2) U13.14(CSB1)

### Notes on the sheet
- IMU
- Magnetometer
  I2C Buffer
- NC
- NC
- Magnetometer Breaker
  Limited to 50mA by R2
- IMU + MAG Interface

## Library data of the parts
C1-C4 C8-C10 C13-C16 C23-C25 C33-C35 C46 C48-C50 = oresat-rcl:C-EU: CAPACITOR, European symbol; DIS: Digi-Key; DPN: 311-1446-1-ND; MFR: Yageo; MPN: CC0603KRX7R7BB105
C6 C21 C28 C29 C31 C37-C39 C43 = oresat-rcl:C-EU: CAPACITOR, European symbol; DIS: Digi-Key; DPN: 1276-CL10B104KB8NNNLCT-ND; MFR: Samsung; MPN: CL10B104KB8NNNL
C7 C12 C22 C32 C44 = oresat-rcl:C-EU: CAPACITOR, European symbol
C11 = oresat-rcl:C-EU: CAPACITOR, European symbol; DIS: Digi-Key; DPN: 1276-1001-1-ND; MFR: Samsung; MPN: CL05B104KO5NNNC
C30 C36 = oresat-rcl:C-EU: CAPACITOR, European symbol; DIS: Digi-Key; DPN: 1276-1187-1-ND; MFR: Samsung; MPN: CL10C200JB8NNNC
C45 = oresat-rcl:C-EU: CAPACITOR, European symbol; DIS: Digi-Key; DPN: 1276-6472-1-ND; MFR: Samsung; MPN: CL21B106KOQNNNG
C47 = oresat-rcl:C-EU: CAPACITOR, European symbol; DIS: Digi-Key; DPN: 490-9959-1-ND; MFR: Murata; MPN: GRM21BD71A226ME44L
D2 D4 D6 D10 D14 D18 = SparkFun-LED:LED-GREEN: Green SMD LED Used in manufacturing of various products at SparkFun Packages: 0603 - SMD 0603 package [Product Link] <http://www.futureelectronics.com/en/technologies/semiconductors/optoelectronics/leds/Pages/9894312-LTST-C190GKT.aspx?CrossPart=HSMG-C190&IM=0> LilyPad 1206 - SMD1206 LilyPad package [Product Link] <http://www.futureelectronics.com/en/Technologies/Product.aspx?ProductID=IN150NGHARVATEKCORPORATION2049943&IM=0> 1206 - SMD1206 package [Product Link] <http://www.futureelectronics.com/en/technologies/semiconductors/optoelectronics/leds/Pages/8315665-LTST-C150KGKT.aspx?IM=0> 1206 Bottom Mount -SMD 1206 Bottom Mount [Product Link] <http://www.digikey.com/product-detail/en/lite-on-inc/LTST-C230KGKT/160-1456-1-ND/386854> SparkFun Products: Pro Mini 328 -5V <https://www.sparkfun.com/products/821> RedBoard <https://www.sparkfun.com/products/12757> MP3 Trigger <https://www.sparkfun.com/products/13720> Makey Makey <https://www.sparkfun.com/products/11076>; DIS: Digi-Key; DPN: 1830-1064-1-ND; MFR: Inolux; MPN: IN-S63AT5A; VALUE: GREEN
D3 D5 D9 D13 D16 D17 = SparkFun-LED:LED-GREEN: Green SMD LED Used in manufacturing of various products at SparkFun Packages: 0603 - SMD 0603 package [Product Link] <http://www.futureelectronics.com/en/technologies/semiconductors/optoelectronics/leds/Pages/9894312-LTST-C190GKT.aspx?CrossPart=HSMG-C190&IM=0> LilyPad 1206 - SMD1206 LilyPad package [Product Link] <http://www.futureelectronics.com/en/Technologies/Product.aspx?ProductID=IN150NGHARVATEKCORPORATION2049943&IM=0> 1206 - SMD1206 package [Product Link] <http://www.futureelectronics.com/en/technologies/semiconductors/optoelectronics/leds/Pages/8315665-LTST-C150KGKT.aspx?IM=0> 1206 Bottom Mount -SMD 1206 Bottom Mount [Product Link] <http://www.digikey.com/product-detail/en/lite-on-inc/LTST-C230KGKT/160-1456-1-ND/386854> SparkFun Products: Pro Mini 328 -5V <https://www.sparkfun.com/products/821> RedBoard <https://www.sparkfun.com/products/12757> MP3 Trigger <https://www.sparkfun.com/products/13720> Makey Makey <https://www.sparkfun.com/products/11076>; DIS: Digi-Key; DPN: 511-1584-1-ND; MFR: Rohm; MPN: SML-E12M8WT86
FIDUCIAL1-FIDUCIAL6 = dock_v2:FIDUCIAL: Fiducials for optical coordinate reference
J2 = oresat-debug-connector:ORESAT-DEBUG-CONNECTOR
J6 = J-Samtec-TFM-120-X1-XXX-D-RA:J-SAMTEC-TFM-120-X1-XXX-D-RA; DIS: Digi-Key; DPN: SAM10145-ND; MFR: Samtec; MPN: TFM-120-01-L-D-RA
L3 = L-ECS-MPI4040:L-ECS-MPI4040; DIS: Digi-Key; DPN: XC2337CT-ND; MFR: ECS; MPN: ECS-MPI4040R4-6R8-R
MAG_PIN_Q1-MAG_PIN_Q4 = pinhead:PINHD-1X2: PIN HEADER
PCB1 = oresat-cards:ORESAT-CARD-V1.3-GENERIC-0RF
Q6 Q7 Q11 Q12 Q21 Q22 Q26 Q27 Q31 Q32 = Q-MOSFET-PCH-SOT23-6:MOSFET-PCH-SOT23-6: P channel MOSFET in an SOT23-6; DIS: Digi-Key; DPN: DMP3050LVT-7DICT-ND; MFR: Diodes Inc; MPN: DMP3050LVT-7
Q8 Q9 Q13 Q14 Q23 Q24 Q28 Q29 Q33 Q34 = Tova:PMV45EN; DIS: Digi-Key; DPN: 1727-2307-1-ND; MFR: Nexperia; MPN: PMV45EN2R
Q10 Q15 Q25 Q30 Q35 = Q-MOSFET-PCH-dual-SOT23-6:MOSFET-PCH-SOT23-6: Dual P channel MOSFETs in an SOT23-6; DIS: Digi-Key; DPN: DMP2240UDMDICT-ND; MFR: Diodes Inc; MPN: DMP2240UDM
QUADRANT1-QUADRANT4 = oresat-ACS_driver_board:MEZZANINE_PLUG; DIS: Digi-Key; DPN: WM9218CT-ND; MFR: Molex; MPN: 0555600307
R1 R3-R7 R9 R10 R13 R54-R56 R58 R63 R66 R92-R94 R96 R101 R104 R168-R170 R172 R177 R180 R214-R216 R218 R223 R226 R227 R244-R246 R248 R253 R256 = oresat-rcl:R-US_: RESISTOR, American symbol; DIS: Digi-Key; DPN: 311-10.0KHRCT-ND; MFR: Yageo; MPN: RC0603FR-0710KL
R2 = oresat-rcl:R-US_: RESISTOR, American symbol; DIS: Digi-Key; DPN: 311-23.7KHRCT-ND; MFR: Yageo; MPN: RC0603FR-0723K7L
R8 R11 R12 R39 R67 R77 R105 R153 R181 R198 R199 R229 R257 R267 = oresat-rcl:R-US_: RESISTOR, American symbol; DIS: Digi-Key; DPN: A129693CT-ND; MFR: TE Connectivity; MPN: CRGCQ0603F2K7
R40 R78 R154 R200 R230 = oresat-rcl:R-US_: RESISTOR, American symbol; DIS: Digi-Key; DPN: 311-10.0HRCT-ND; MFR: Yageo; MPN: RC0603FR-0710RL
R41-R52 R60 R62 R64 R65 R79-R90 R98 R100 R102 R103 R155-R166 R174 R176 R178 R179 R201-R212 R220 R222 R224 R225 R228 R231-R242 R250 R252 R254 R255 = oresat-rcl:R-US_: RESISTOR, American symbol; DIS: Digi-Key; DPN: 1276-4275-1-ND; MFR: Samsung; MPN: RC1005F6653CS
R53 R73 R91 R111 R167 R187 R213 R243 R263 R271 = oresat-rcl:R-US_: RESISTOR, American symbol; DIS: Digi-Key; DPN: 311-100HRCT-ND; MFR: Yageo; MPN: RC0603FR-07100RL
R57 R95 R171 R217 R247 = rcl:R-US_: RESISTOR, American symbol; DIS: Digi-Key; DPN: CSR1206FTR100CT-ND; MFR: Stackpole; MPN: CSR1206FTR100; SPICEPREFIX: R
R59 R61 R97 R99 R173 R175 R219 R221 R249 R251 = oresat-rcl:R-US_: RESISTOR, American symbol; DIS: Digi-Key; DPN: 311-0.0GRCT-ND; MFR: Yageo; MPN: RC0603JR-070RL
R68 R74 R106 R112 R182 R188 R258 R264 R268 R272 = oresat-rcl:R-US_: RESISTOR, American symbol; DIS: Digi-Key; DPN: 311-665KHRCT-ND; MFR: Yageo; MPN: RC0603FR-07665KL
R69 R70 R107 R108 R183 R184 R259 R260 = oresat-rcl:R-US_: RESISTOR, American symbol; DIS: Digi-Key; DPN: 311-47.0KHRCT-ND; MFR: Yageo; MPN: RC0603FR-0747KL
R71 R75 R109 R113 R185 R189 R261 R265 R269 R273 = oresat-rcl:R-US_: RESISTOR, American symbol; DIS: Digi-Key; DPN: 749-1638-1-ND; MFR: Vishay; MPN: MCT06030C3303FP000
R72 R76 R110 R114 R186 R190 R262 R266 R270 R274 = oresat-rcl:R-US_: RESISTOR, American symbol; DIS: Digi-Key; DPN: 311-1.00MHRCT-ND; MFR: Yageo; MPN: RC0603FR-071ML
TP1-TP19 TP21 TP23-TP45 TP61-TP75 TP89-TP121 = oresat-misc:TEST-POINT-LARGE-SQUARE
U1 = U-Maxim-MAX892LEUA+T-power-switch:MAX892LEUA+T: MAX891L / MAX892L Current-Limited, High-Side P-Channel Switch with Thermal Shutdown; DIS: Digi-Key; DPN: MAX892LEUA+-ND; MANUFACTURER_PART_NUMBER: MAX892LEUA+T; MFR: Maxim; MPN: MAX892LEUA+; VENDOR: Maxim Integrated Products
U2 = U-Linear-LTC4300A-1-2-Wire-Bus-Buffer:LTC4300A-1; DIS: Digi-Key; DPN: LTC4300A-1IMS8#TRPBFCT-ND; MFR: Linear; MPN: LTC4300A-1IMS8#TRPBF
U5 U9 U17 U25 U29 = U-Maxim-MAX7310-I2C-GPIO-expander:MAX7310; DIS: Digi-Key; DPN: MAX7310ATE+-ND; MFR: Maxim; MPN: MAX7310ATE
U6 U10 U18 U26 U30 = U-Maxim-MAX4211-power-monitor:MAX4211; DIS: Digi-Key; DPN: MAX4211FETE+-ND; MFR: Maxim; MPN: MAX4211FETE
U7 U8 U11 U12 U19 U20 U27 U28 U32 U33 = U-Microchip-MIC842-Comparator:MIC842L; DIS: Digi-Key; DPN: 576-2927-1-ND; MFR: Microchip; MPN: MIC842LYC5-TR
U13 = BMI088:BMI088: High-performance 6-axis inertial sensor (accelerometer + gyroscope); AVAILABILITY: Unavailable; DESCRIPTION: Accelerometer, Gyroscope, 6 Axis Sensor I²C, SPI Output; DIS: Digi-Key; DPN: 828-1082-1-ND; MF: Bosch Sensortec; MFR: Bosch Sensortec; MP: BMI088; MPN: BMI088; PACKAGE: VFLGA-16 Bosch Sensortec; PRICE: None
U14 = TCAN330:TCAN330; DIS: Digi-Key; DPN: 296-44211-1-ND; MFR: Texas Instruments; MPN: TCAN330GDCNT
U15 = U-ST-STM32F091C-uC:STM32F091C; DIS: Digi-Key; DPN: 497-18516-ND; MFR: STMicroelectronics; MPN: STM32F042K6T7
U31 = U-TI-TPS6211x-SPS-buck:TPS6211X: TPS6211x 17-V, 1.5-A, Synchronous Step-Down Converter; DIS: Digi-Key; DPN: 296-37681-2-ND; MFR: Texas Instruments; MPN: TPS62111RSA
U$1 = oresat-flight-marker:FLIGHMARKER
X2 = low-gain-radio:CRYSTAL-WITH-GND; DIS: Digi-Key; DPN: XC2181CT-ND; MFR: ECS Inc.; MPN: ECS-160-10-36Q-ES-TR